# EAGLE design csa_petio_v1.1b (EAGLE 4.15)
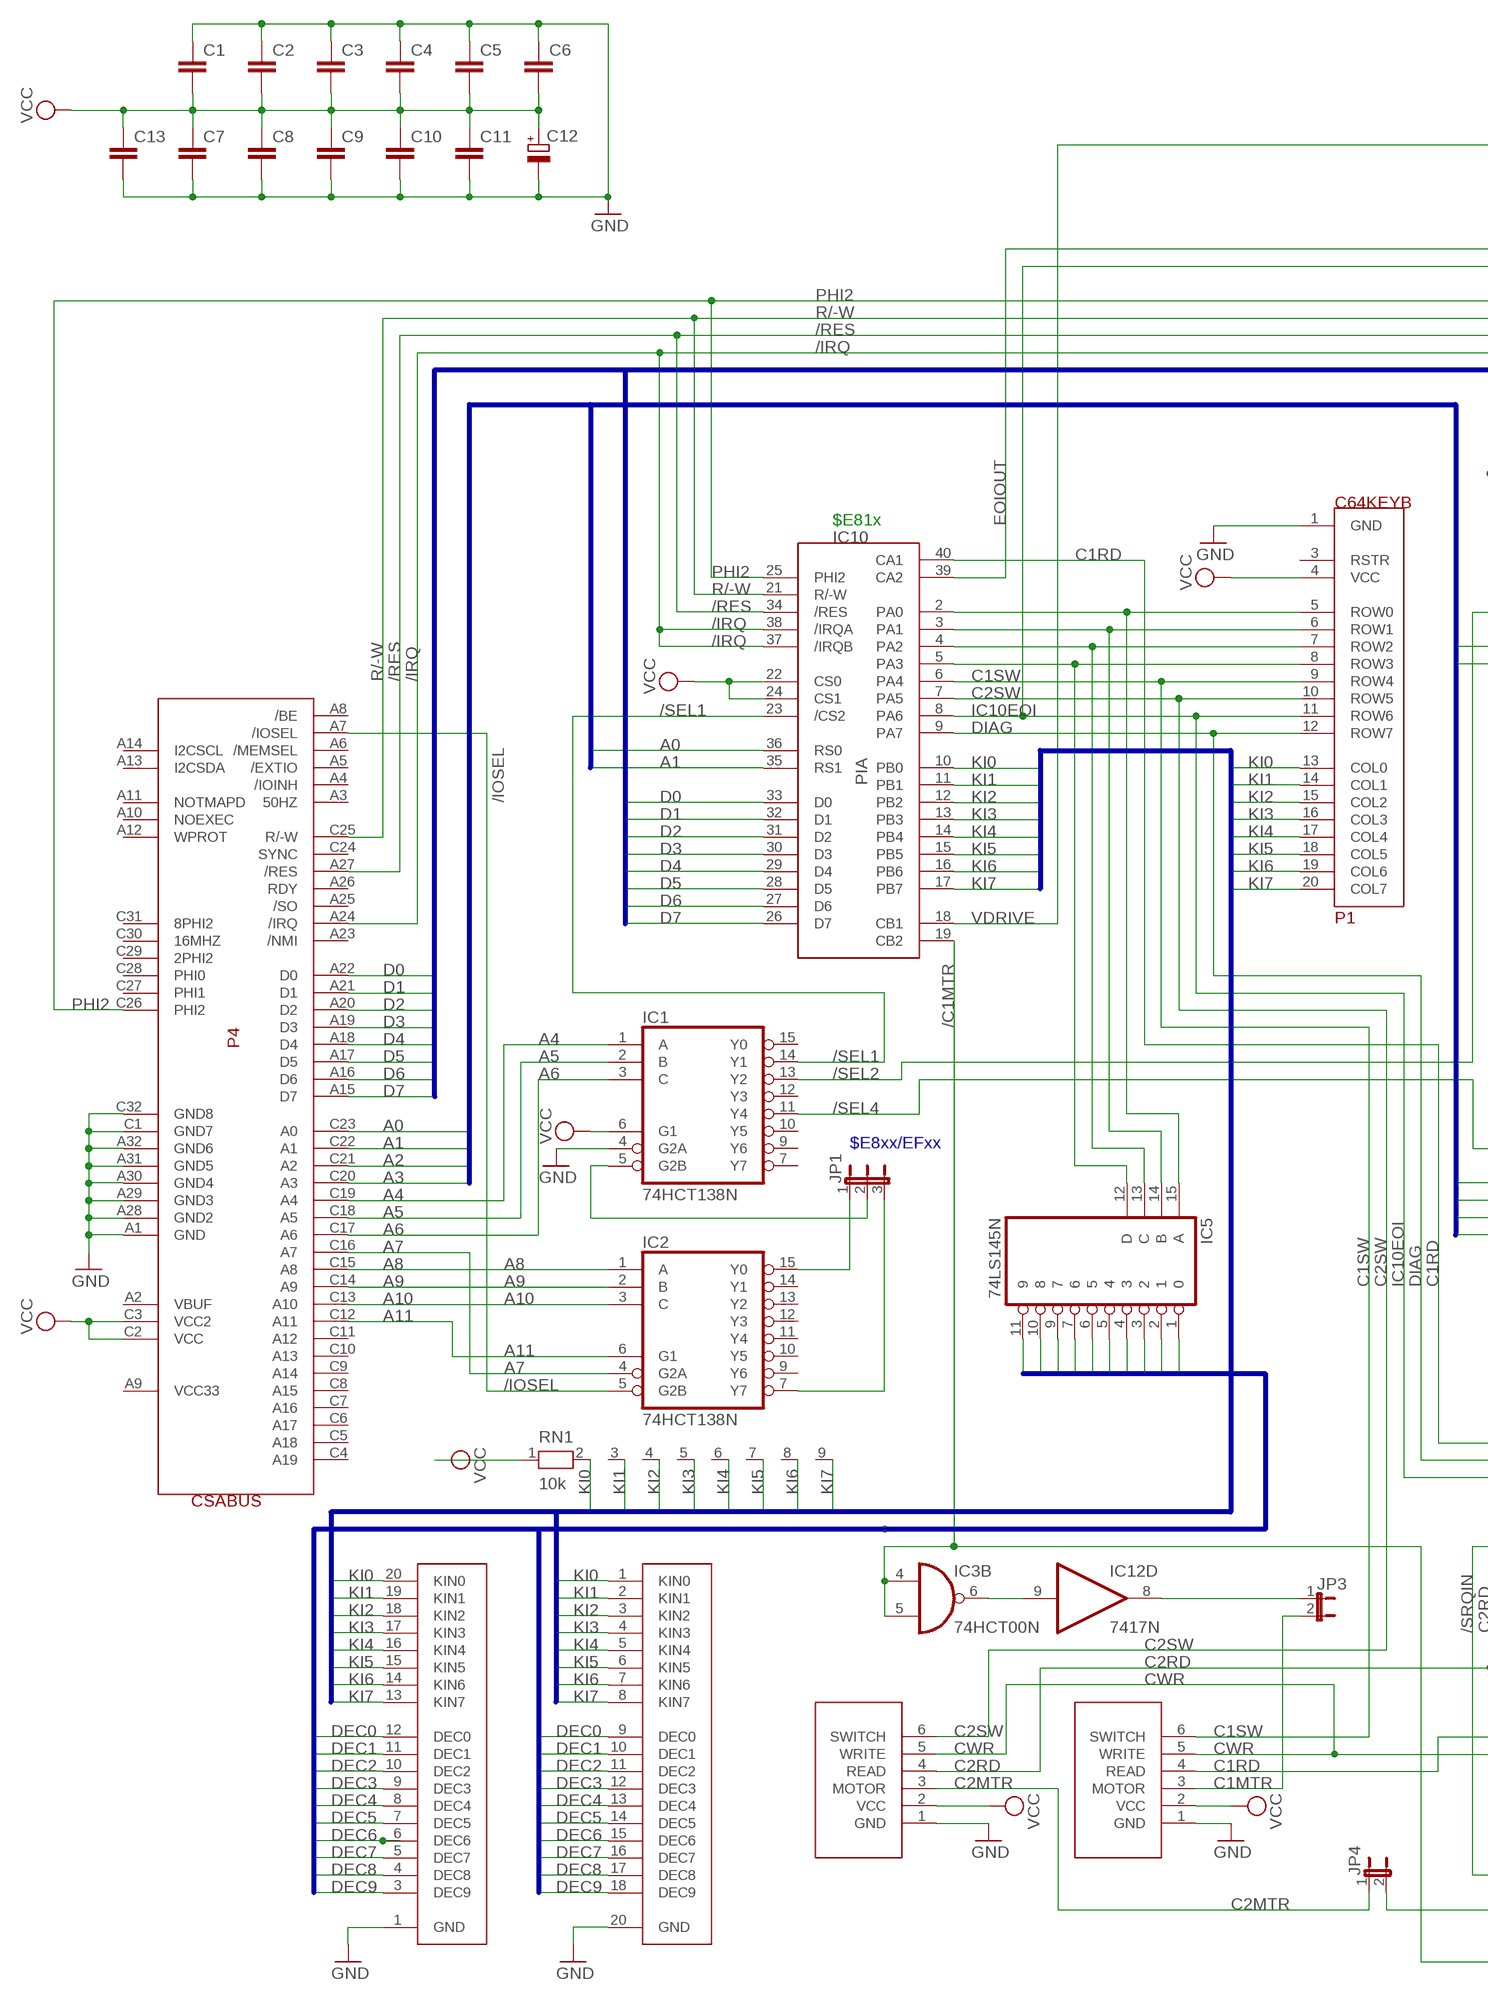
[diagram p0: schematic, sheet 1, part 1 of 2]
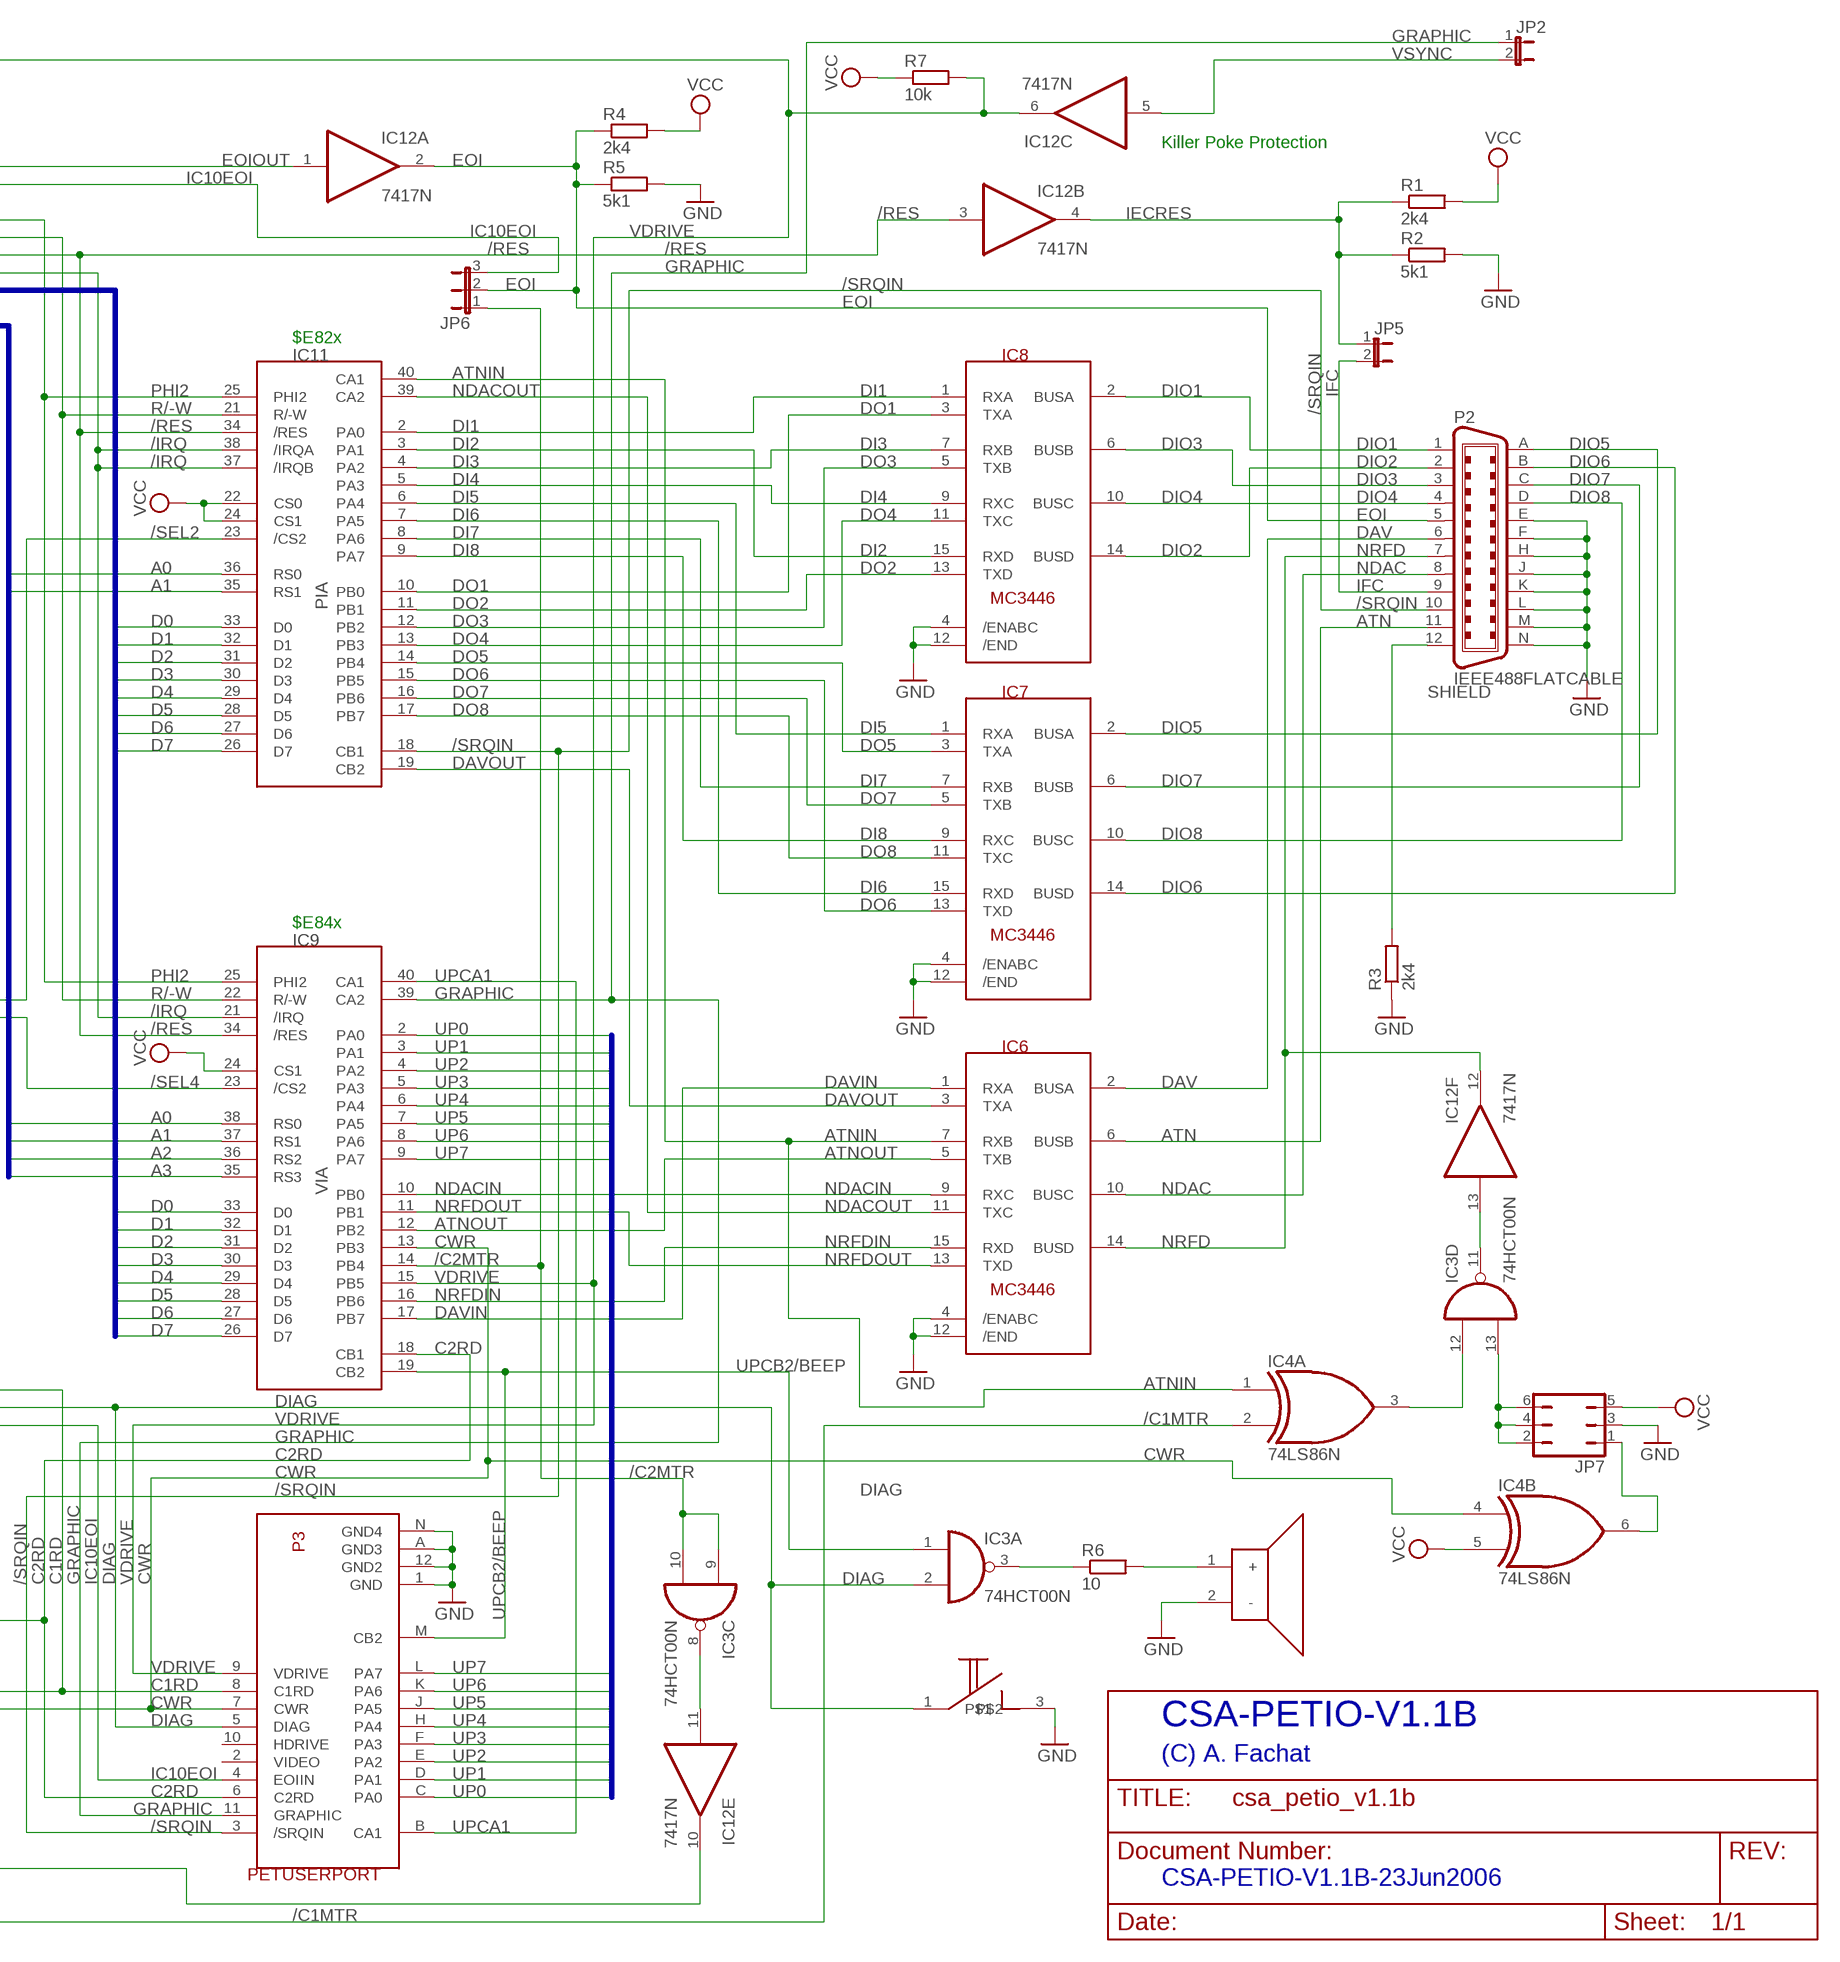
[diagram p1: schematic, sheet 1, part 2 of 2]

## Parts
BEEP1  PIEZOBEEPERPIEZO  [PIEZOBEEPER]
C1  C-EU025-025X050  [C025-025X050]
C2  C-EU025-025X050  [C025-025X050]
C3  C-EU025-025X050  [C025-025X050]
C4  C-EU025-025X050  [C025-025X050]
C5  C-EU025-025X050  [C025-025X050]
C6  C-EU025-025X050  [C025-025X050]
C7  C-EU025-025X050  [C025-025X050]
C8  C-EU025-025X050  [C025-025X050]
C9  C-EU025-025X050  [C025-025X050]
C10  C-EU025-025X050  [C025-025X050]
C11  C-EU025-025X050  [C025-025X050]
C12  CPOL-EUE2.5-6  [E2,5-6]
C13  C-EU025-025X050  [C025-025X050]
IC1  74HCT138N  [DIL16]
IC2  74HCT138N  [DIL16]
IC3  74HCT00N  [DIL14]
IC4  74LS86N  [DIL14]
IC5  74LS145N  [DIL16]
IC6  MC3446  [DIL16]
IC7  MC3446  [DIL16]
IC8  MC3446  [DIL16]
IC9  VIA  [DIL40]
IC10  PIA  [DIL40]
IC11  PIA  [DIL40]
IC12  7417N  [DIL14]
JP1  JP2E  [JP2]
JP2  JP1E  [JP1]
JP3  JP1E  [JP1]
JP4  JP1E  [JP1]
JP5  JP1E  [JP1]
JP6  JP2E  [JP2]
JP7  JP3Q  [JP3Q]
P1  C64KEYB  [C64KEYB]
P2  IEEE488FLATCABLE  [FLAT24]
P3  PETUSERPORT  [FLAT24]
P4  CSABUS  [CSABUS]
P5  CBMTAPE  [JP6]
P6  CBMTAPE  [JP6]
R1  2k4  R-EU_0207/10  [0207/10]
R2  5k1  R-EU_0207/10  [0207/10]
R3  2k4  R-EU_0207/10  [0207/10]
R4  2k4  R-EU_0207/10  [0207/10]
R5  5k1  R-EU_0207/10  [0207/10]
R6  10  R-EU_0207/10  [0207/10]
R7  10k  R-EU_0207/10  [0207/10]
RN1  10k  RN08  [RN-9]
U$1  PETKEYBD  [C64KEYB]
U$2  TASTER  [TASTER]
U$3  PETKEYBDSUBD  [SUBD25F]

## Nets
/C1MTR: IC3.4(B:I0) IC3.5(B:I1) IC4.2(A:I1) IC10.19(CB2)
/C2MTR: IC3.9(C:I0) IC3.10(C:I1) IC9.14(PB4) JP6.1
/IOSEL: IC2.5(G2B) P4.A7(/IOSEL)
/IRQ: IC9.21(/IRQ) IC10.37(/IRQB) IC10.38(/IRQA) IC11.37(/IRQB) IC11.38(/IRQA) P4.A24(/IRQ)
/RES: IC9.34(/RES) IC10.34(/RES) IC11.34(/RES) IC12.3(B:I) P4.A27(/RES)
/SEL1: IC1.14(Y1) IC10.23(/CS2)
/SEL2: IC1.13(Y2) IC11.23(/CS2)
/SEL4: IC1.11(Y4) IC9.23(/CS2)
/SRQIN: IC11.18(CB1) P2.10 P3.3(/SRQIN)
A0: IC9.38(RS0) IC10.36(RS0) IC11.36(RS0) P4.C23(A0)
A1: IC9.37(RS1) IC10.35(RS1) IC11.35(RS1) P4.C22(A1)
A2: IC9.36(RS2) P4.C21(A2)
A3: IC9.35(RS3) P4.C20(A3)
A4: IC1.1(A) P4.C19(A4)
A5: IC1.2(B) P4.C18(A5)
A6: IC1.3(C) P4.C17(A6)
A7: IC2.4(G2A) P4.C16(A7)
A8: IC2.1(A) P4.C15(A8)
A9: IC2.2(B) P4.C14(A9)
A10: IC2.3(C) P4.C13(A10)
A11: IC2.6(G1) P4.C12(A11)
ATN: IC6.6(BUSB) P2.11
ATNIN: IC4.1(A:I0) IC6.7(RXB) IC11.40(CA1)
ATNOUT: IC6.5(TXB) IC9.12(PB2)
C1MTR: JP3.2 P5.3(MOTOR)
C1RD: IC10.40(CA1) P3.8(C1RD) P5.4(READ)
C1SW: IC10.6(PA4) P1.9(ROW4) P5.6(SWITCH)
C2MTR: JP4.1 P6.3(MOTOR)
C2RD: IC9.18(CB1) P3.6(C2RD) P6.4(READ)
C2SW: IC10.7(PA5) P1.10(ROW5) P6.6(SWITCH)
CWR: IC4.4(B:I0) IC9.13(PB3) P3.7(CWR) P5.5(WRITE) P6.5(WRITE)
D0: IC9.33(D0) IC10.33(D0) IC11.33(D0) P4.A22(D0)
D1: IC9.32(D1) IC10.32(D1) IC11.32(D1) P4.A21(D1)
D2: IC9.31(D2) IC10.31(D2) IC11.31(D2) P4.A20(D2)
D3: IC9.30(D3) IC10.30(D3) IC11.30(D3) P4.A19(D3)
D4: IC9.29(D4) IC10.29(D4) IC11.29(D4) P4.A18(D4)
D5: IC9.28(D5) IC10.28(D5) IC11.28(D5) P4.A17(D5)
D6: IC9.27(D6) IC10.27(D6) IC11.27(D6) P4.A16(D6)
D7: IC9.26(D7) IC10.26(D7) IC11.26(D7) P4.A15(D7)
DAV: IC6.2(BUSA) P2.6
DAVIN: IC6.1(RXA) IC9.17(PB7)
DAVOUT: IC6.3(TXA) IC11.19(CB2)
DEC0: IC5.1 U$1.12(DEC0) U$3.9(DEC0)
DEC1: IC5.2 U$1.11(DEC1) U$3.10(DEC1)
DEC2: IC5.3 U$1.10(DEC2) U$3.11(DEC2)
DEC3: IC5.4 U$1.9(DEC3) U$3.12(DEC3)
DEC4: IC5.5 U$1.8(DEC4) U$3.13(DEC4)
DEC5: IC5.6 U$1.7(DEC5) U$3.14(DEC5)
DEC6: IC5.7 U$1.6(DEC6) U$3.15(DEC6)
DEC7: IC5.9 U$1.5(DEC7) U$3.16(DEC7)
DEC8: IC5.10 U$1.4(DEC8) U$3.17(DEC8)
DEC9: IC5.11 U$1.3(DEC9) U$3.18(DEC9)
DI1: IC8.1(RXA) IC11.2(PA0)
DI2: IC8.15(RXD) IC11.3(PA1)
DI3: IC8.7(RXB) IC11.4(PA2)
DI4: IC8.9(RXC) IC11.5(PA3)
DI5: IC7.1(RXA) IC11.6(PA4)
DI6: IC7.15(RXD) IC11.7(PA5)
DI7: IC7.7(RXB) IC11.8(PA6)
DI8: IC7.9(RXC) IC11.9(PA7)
DIAG: IC3.2(A:I1) IC10.9(PA7) P1.12(ROW7) P3.5(DIAG) U$2.1
DIO1: IC8.2(BUSA) P2.1
DIO2: IC8.14(BUSD) P2.2
DIO3: IC8.6(BUSB) P2.3
DIO4: IC8.10(BUSC) P2.4
DIO5: IC7.2(BUSA) P2.A
DIO6: IC7.14(BUSD) P2.B
DIO7: IC7.6(BUSB) P2.C
DIO8: IC7.10(BUSC) P2.D
DO1: IC8.3(TXA) IC11.10(PB0)
DO2: IC8.13(TXD) IC11.11(PB1)
DO3: IC8.5(TXB) IC11.12(PB2)
DO4: IC8.11(TXC) IC11.13(PB3)
DO5: IC7.3(TXA) IC11.14(PB4)
DO6: IC7.13(TXD) IC11.15(PB5)
DO7: IC7.5(TXB) IC11.16(PB6)
DO8: IC7.11(TXC) IC11.17(PB7)
EOI: IC12.2(A:O) JP6.2 P2.5 R4.1 R5.1
EOIOUT: IC10.39(CA2) IC12.1(A:I)
GND: BEEP1.2(-) C1.1 C2.1 C3.1 C4.1 C5.1 C6.1 C7.2 C8.2 C9.2 C10.2 C11.2 C12.- C13.2 IC1.4(G2A) IC6.4(/ENABC) IC6.12(/END) IC7.4(/ENABC) IC7.12(/END) IC8.4(/ENABC) IC8.12(/END) JP7.3 P1.1(GND) P2.E P2.F P2.H P2.J P2.K P2.L P2.M P2.N P3.1(GND) P3.12(GND2) P3.A(GND3) P3.N(GND4) P4.A1(GND) P4.A28(GND2) P4.A29(GND3) P4.A30(GND4) P4.A31(GND5) P4.A32(GND6) P4.C1(GND7) P4.C32(GND8) P5.1(GND) P6.1(GND) R2.2 R3.1 R5.2 U$1.1(GND) U$2.3 U$3.20(GND)
GRAPHIC: IC9.39(CA2) JP2.1 P3.11(GRAPHIC)
IC10EOI: IC10.8(PA6) JP6.3 P1.11(ROW6) P3.4(EOIIN)
IECRES: IC12.4(B:O) JP5.1 R1.1 R2.1
IFC: JP5.2 P2.9
KI0: IC10.10(PB0) P1.13(COL0) RN1.2 U$1.20(KIN0) U$3.1(KIN0)
KI1: IC10.11(PB1) P1.14(COL1) RN1.3 U$1.19(KIN1) U$3.2(KIN1)
KI2: IC10.12(PB2) P1.15(COL2) RN1.4 U$1.18(KIN2) U$3.3(KIN2)
KI3: IC10.13(PB3) P1.16(COL3) RN1.5 U$1.17(KIN3) U$3.4(KIN3)
KI4: IC10.14(PB4) P1.17(COL4) RN1.6 U$1.16(KIN4) U$3.5(KIN4)
KI5: IC10.15(PB5) P1.18(COL5) RN1.7 U$1.15(KIN5) U$3.6(KIN5)
KI6: IC10.16(PB6) P1.19(COL6) RN1.8 U$1.14(KIN6) U$3.7(KIN6)
KI7: IC10.17(PB7) P1.20(COL7) RN1.9 U$1.13(KIN7) U$3.8(KIN7)
N$1: IC3.12(D:I0) IC4.3(A:O)
N$2: IC3.13(D:I1) JP7.2 JP7.4 JP7.6
N$3: IC3.3(A:O) R6.1
N$4: BEEP1.1(+) R6.2
N$15: IC3.11(D:O) IC12.13(F:I)
N$16: IC3.6(B:O) IC12.9(D:I)
N$17: IC12.8(D:O) JP3.1
N$19: IC12.10(E:O) JP4.2
N$20: IC5.15(A) IC10.2(PA0) P1.5(ROW0)
N$21: IC5.14(B) IC10.3(PA1) P1.6(ROW1)
N$22: IC5.13(C) IC10.4(PA2) P1.7(ROW2)
N$23: IC5.12(D) IC10.5(PA3) P1.8(ROW3)
N$24: IC3.8(C:O) IC12.11(E:I)
N$27: IC4.6(B:O) JP7.1
N$32: IC1.5(G2B) JP1.2
N$33: IC2.15(Y0) JP1.1
N$34: IC2.7(Y7) JP1.3
NDAC: IC6.10(BUSC) P2.8
NDACIN: IC6.9(RXC) IC9.10(PB0)
NDACOUT: IC6.11(TXC) IC11.39(CA2)
NRFD: IC6.14(BUSD) IC12.12(F:O) P2.7
NRFDIN: IC6.15(RXD) IC9.16(PB6)
NRFDOUT: IC6.13(TXD) IC9.11(PB1)
PHI2: IC9.25(PHI2) IC10.25(PHI2) IC11.25(PHI2) P4.C26(PHI2)
R/-W: IC9.22(R/-W) IC10.21(R/-W) IC11.21(R/-W) P4.C25(R/-W)
SHIELD: P2.12 R3.2
UP0: IC9.2(PA0) P3.C(PA0)
UP1: IC9.3(PA1) P3.D(PA1)
UP2: IC9.4(PA2) P3.E(PA2)
UP3: IC9.5(PA3) P3.F(PA3)
UP4: IC9.6(PA4) P3.H(PA4)
UP5: IC9.7(PA5) P3.J(PA5)
UP6: IC9.8(PA6) P3.K(PA6)
UP7: IC9.9(PA7) P3.L(PA7)
UPCA1: IC9.40(CA1) P3.B(CA1)
UPCB2/BEEP: IC3.1(A:I0) IC9.19(CB2) P3.M(CB2)
VCC: C1.2 C2.2 C3.2 C4.2 C5.2 C6.2 C7.1 C8.1 C9.1 C10.1 C11.1 C12.+ C13.1 IC1.6(G1) IC4.5(B:I1) IC9.24(CS1) IC10.22(CS0) IC10.24(CS1) IC11.22(CS0) IC11.24(CS1) JP7.5 P1.4(VCC) P4.C2(VCC) P4.C3(VCC2) P5.2(VCC) P6.2(VCC) R1.2 R4.2 R7.1 RN1.1
VDRIVE: IC9.15(PB5) IC10.18(CB1) IC12.6(C:O) P3.9(VDRIVE) R7.2
VSYNC: IC12.5(C:I) JP2.2
Unconnected: IC1.7(Y7) IC1.9(Y6) IC1.10(Y5) IC1.12(Y3) IC1.15(Y0) IC2.9(Y6) IC2.10(Y5) IC2.11(Y4) IC2.12(Y3) IC2.13(Y2) IC2.14(Y1) IC4.8(C:O) IC4.9(C:I0) IC4.10(C:I1) IC4.11(D:O) IC4.12(D:I0) IC4.13(D:I1) P1.3(RSTR) P3.2(VIDEO) P3.10(HDRIVE) P4.A2(VBUF) P4.A3(50HZ) P4.A4(/IOINH) P4.A5(/EXTIO) P4.A6(/MEMSEL) P4.A8(/BE) P4.A9(VCC33) P4.A10(NOEXEC) P4.A11(NOTMAPD) P4.A12(WPROT) P4.A13(I2CSDA) P4.A14(I2CSCL) P4.A23(/NMI) P4.A25(/SO) P4.A26(RDY) P4.C4(A19) P4.C5(A18) P4.C6(A17) P4.C7(A16) P4.C8(A15) P4.C9(A14) P4.C10(A13) P4.C11(A12) P4.C24(SYNC) P4.C27(PHI1) P4.C28(PHI0) P4.C29(2PHI2) P4.C30(16MHZ) P4.C31(8PHI2)

## Buses
D[0..7]
A[0..3]
KI[0..7]
UP[0..7]
DEC[0..9]

## Notes on the sheet
- Killer Poke Protection
- $E82x
- $E81x
- $E84x
- $E8xx/EFxx
- CSA-PETIO-V1.1B
- (C) A. Fachat
- CSA-PETIO-V1.1B-23Jun2006

## Power pins joined to a net without a drawn wire
GND: IC1.8(GND) IC2.8(GND) IC3.7(P:GND) IC4.7(P:GND) IC5.8(GND) IC6.8(GND) IC7.8(GND) IC8.8(GND) IC9.1(GND) IC10.1(GND) IC11.1(GND) IC12.7(P:GND)
VCC: IC1.16(VCC) IC2.16(VCC) IC3.14(P:VCC) IC4.14(P:VCC) IC5.16(VCC) IC6.16(VCC) IC7.16(VCC) IC8.16(VCC) IC9.20(VCC) IC10.20(VCC) IC11.20(VCC) IC12.14(P:VCC)

## Library data of the parts
BEEP1 = csa:PIEZOBEEPER
C1-C11 C13 = rcl:C-EU: CAPACITOR, European symbol
C12 = rcl:CPOL-EU: POLARIZED CAPACITOR, European symbol
IC1 IC2 = 74xx-eu:74*138: 3-line to 8-line DECODER/DEMULTIPLEXER
IC3 = 74xx-eu:74*00: Quad 2-input NAND gate
IC4 = 74xx-us:74*86: Quad 2-input EXCLUSIV-OR (XOR) gate
IC5 = 74xx-eu:74*145: BCD to decimal DECODER/DRIVER
IC6-IC8 = csa:MC3446
IC9 = csa:VIA
IC10 IC11 = csa:PIA
IC12 = 74xx-eu:74*17: Hex open collector, high-voltage
JP1 JP6 = jumper:JP2E: JUMPER
JP2-JP5 = jumper:JP1E: JUMPER
JP7 = jumper:JP3Q: JUMPER
P1 = csa:C64KEYB
P2 = csa:IEEE488
P3 = csa:PETUSERPORT
P4 = csa:CSABUS
P5 P6 = csa:CBMTAPE
R1-R7 = rcl:R-EU_: RESISTOR, European symbol
RN1 = resistor-net:RN08: RESISTOR NETWORK
U$1 U$3 = csa:PETKEYBD
U$2 = csa:TASTER

## Board
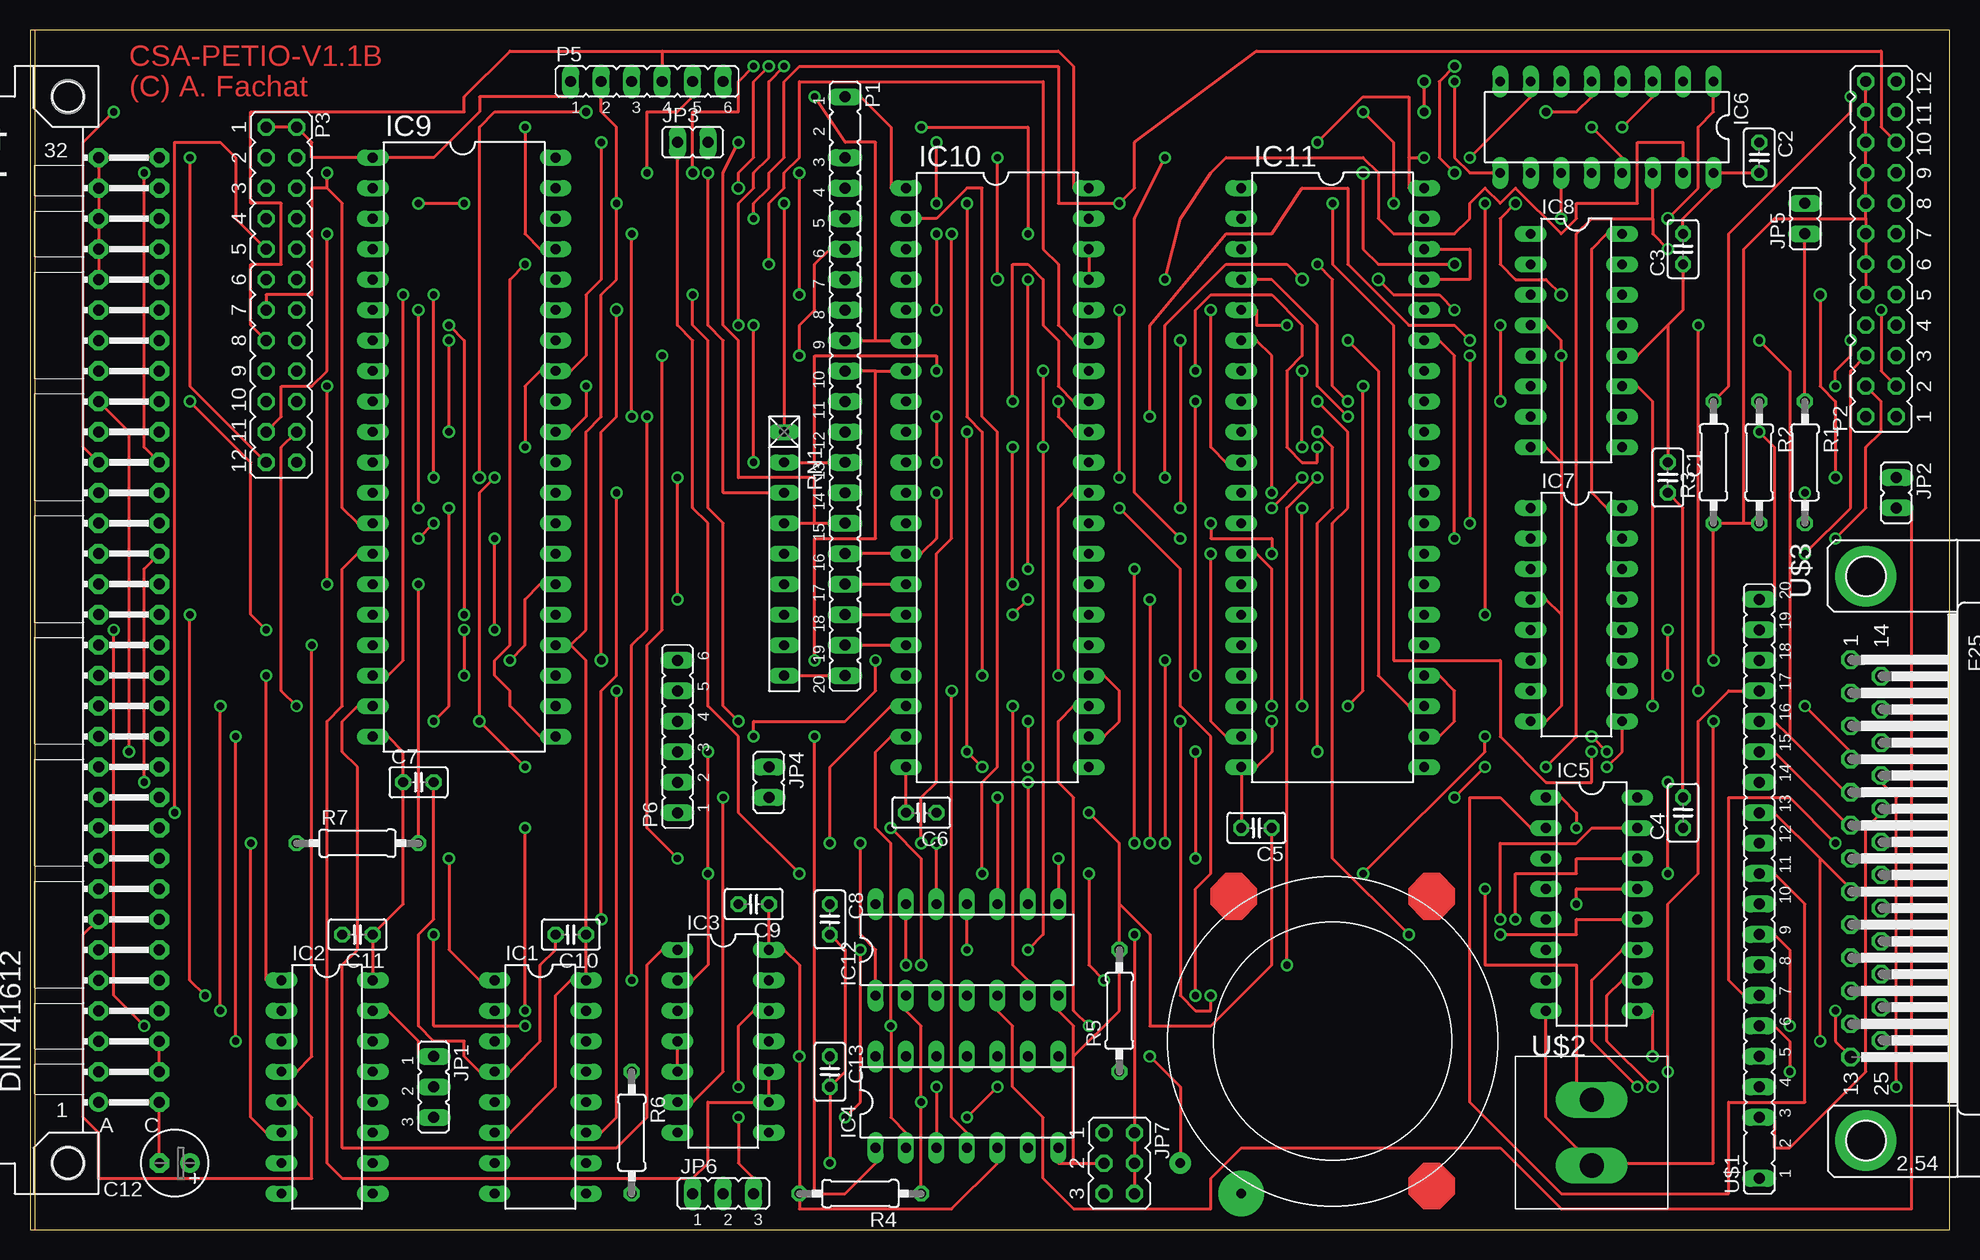
[diagram p2: board, top side]
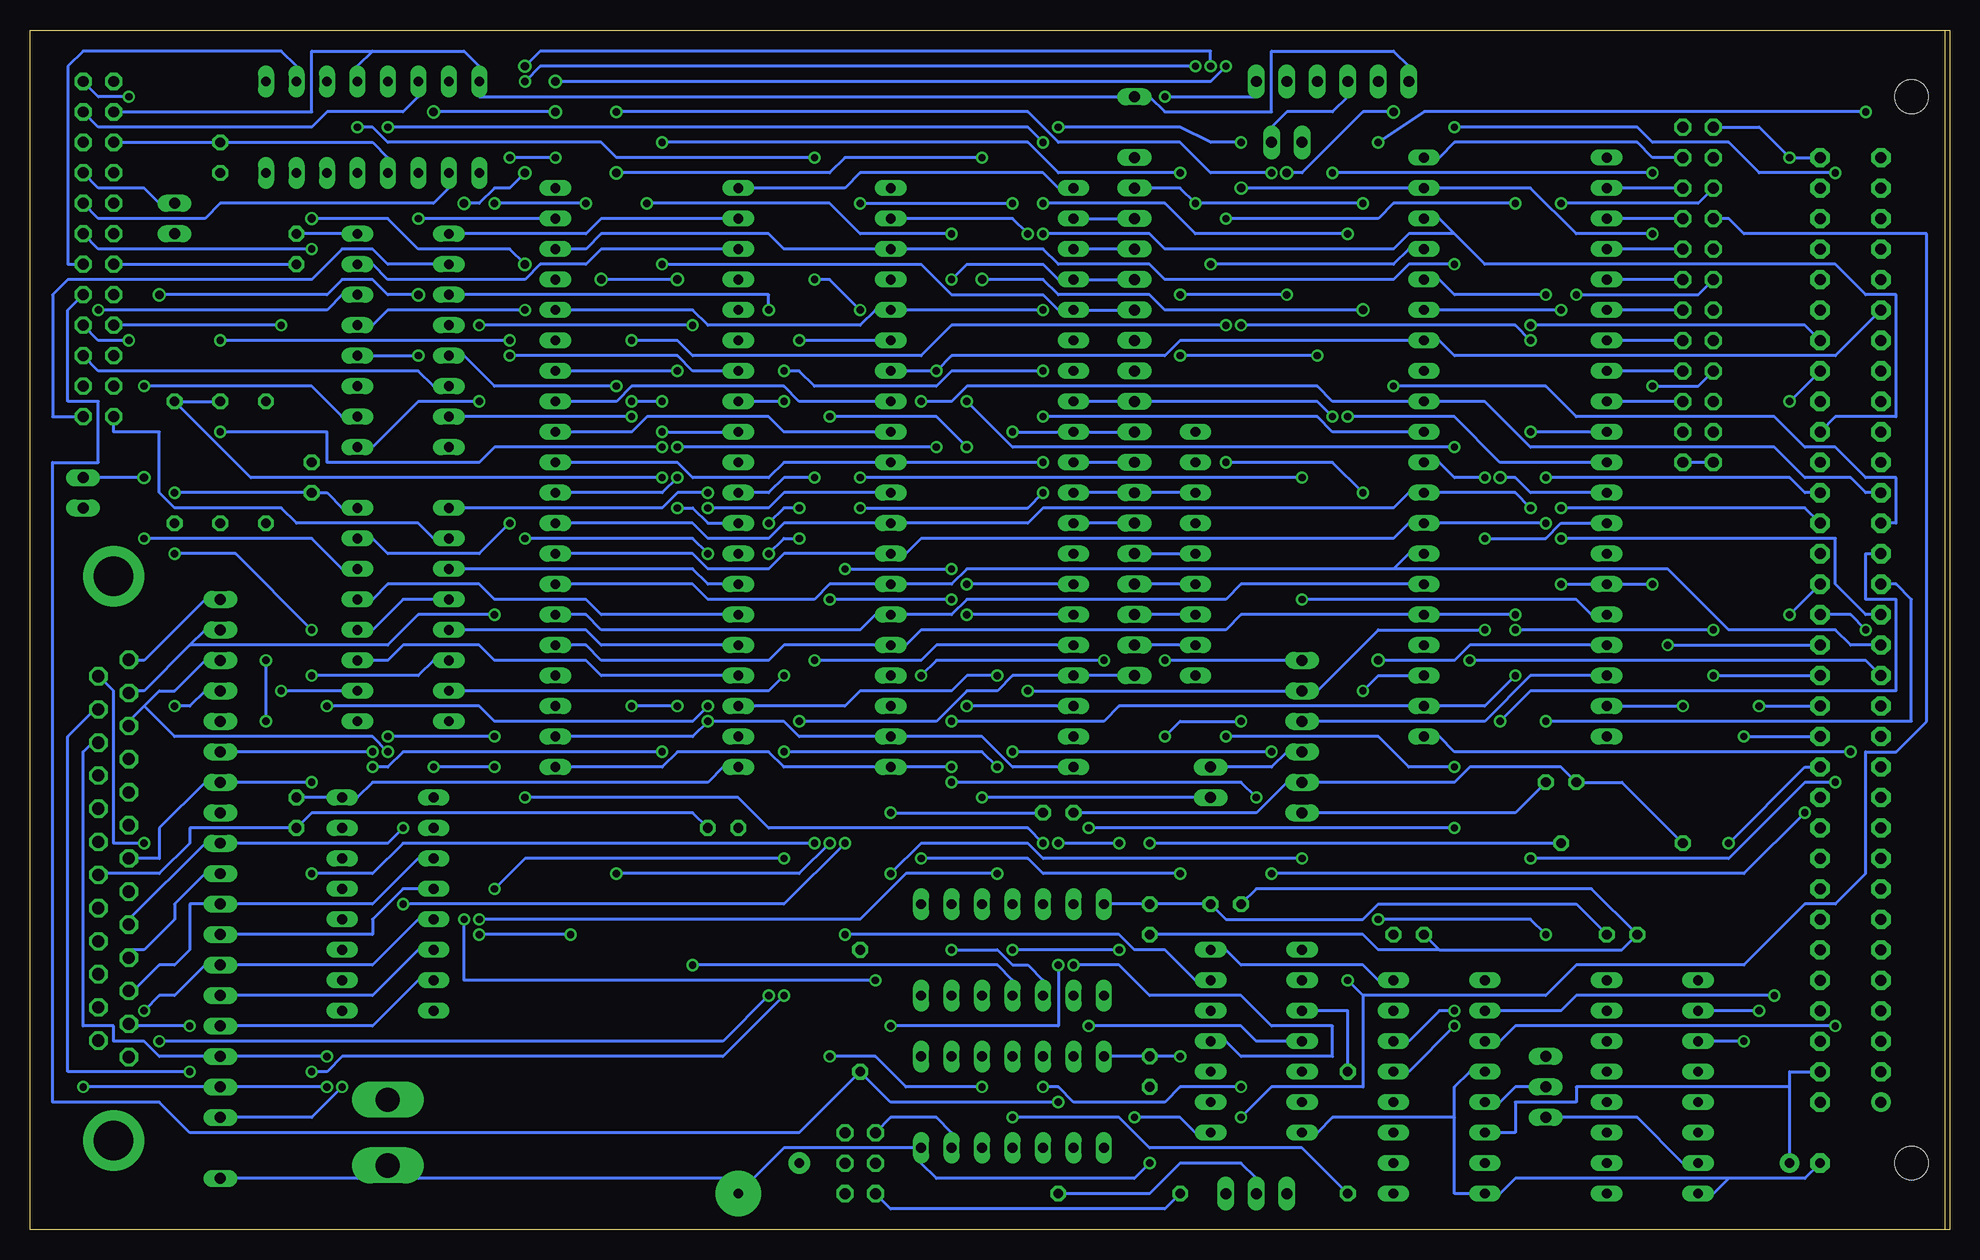
[diagram p3: board, bottom side, seen from below]

Size 160 x 100.03 mm. Coordinates in mm from the lower left corner, seen from the top.
Outline: 0,0.01 160,0.01 160,100.01 0,100.01 0,0.01
Copper layers (1*16): Top 0.035mm / dielectric 1.5mm / Bottom 0.035mm
Design rules "default": minimum track width 10mil, minimum drill 24mil, track to track 8mil, track to pad 8mil, pad to pad 8mil, via to via 8mil, smd to smd 8mil, copper to edge 40mil, drill to drill 8mil, minimum pad ring 10mil, minimum via ring 8mil, stop-mask expansion 4mil, vias tented up to drill 0mil, thermal gap 10mil

### Footprints (pad centres in the part's own frame; a part is rotated, then mirrored left to right if it is on the bottom)
PIEZOBEEPER = drill 0.8 pad 1.778 round: 1 -10.16,12.7 | drill 0.8 pad 3.81 round: 2 -12.7,7.62
C025-025X050 = drill 0.813 octagon: 1 -1.27,0; 2 1.27,0
E2,5-6 = drill 0.813 pad 1.6 round: + -1.27,0 | drill 0.813 pad 1.6 octagon: - 1.27,0
DIL16 = drill 0.813 long: 1 -8.89,-3.81; 2 -6.35,-3.81; 3 -3.81,-3.81; 4 -1.27,-3.81; 5 1.27,-3.81; 6 3.81,-3.81; 7 6.35,-3.81; 8 8.89,-3.81; 9 8.89,3.81; 10 6.35,3.81; 11 3.81,3.81; 12 1.27,3.81; 13 -1.27,3.81; 14 -3.81,3.81; 15 -6.35,3.81; 16 -8.89,3.81
DIL14 = drill 0.813 long: 1 -7.62,-3.81; 2 -5.08,-3.81; 3 -2.54,-3.81; 4 0,-3.81; 5 2.54,-3.81; 6 5.08,-3.81; 7 7.62,-3.81; 8 7.62,3.81; 9 5.08,3.81; 10 2.54,3.81; 11 0,3.81; 12 -2.54,3.81; 13 -5.08,3.81; 14 -7.62,3.81
DIL40 = drill 0.813 long: 1 -16.51,-7.62; 2 -13.97,-7.62; 3 -11.43,-7.62; 4 -8.89,-7.62; 5 -6.35,-7.62; 6 -3.81,-7.62; 7 -1.27,-7.62; 8 1.27,-7.62; 9 3.81,-7.62; 10 6.35,-7.62; 11 8.89,-7.62; 12 11.43,-7.62; 13 13.97,-7.62; 14 16.51,-7.62; 15 19.05,-7.62; 16 21.59,-7.62; 17 24.13,-7.62; 18 26.67,-7.62; 19 29.21,-7.62; 20 31.75,-7.62; 21 31.75,7.62; 22 29.21,7.62; 23 26.67,7.62; 24 24.13,7.62; 25 21.59,7.62; 26 19.05,7.62; 27 16.51,7.62; 28 13.97,7.62; 29 11.43,7.62; 30 8.89,7.62; 31 6.35,7.62; 32 3.81,7.62; 33 1.27,7.62; 34 -1.27,7.62; 35 -3.81,7.62; 36 -6.35,7.62; 37 -8.89,7.62; 38 -11.43,7.62; 39 -13.97,7.62; 40 -16.51,7.62
JP2 = drill 0.914 long: 1 -2.54,0; 2 0,0; 3 2.54,0
JP1 = drill 0.914 long: 1 0,-1.27; 2 0,1.27
JP3Q = drill 0.914 octagon: 1 -2.54,-1.27; 2 -2.54,1.27; 3 0,-1.27; 4 0,1.27; 5 2.54,-1.27; 6 2.54,1.27
C64KEYB = drill 0.914 long: 1 0,0; 3 5.08,0; 4 7.62,0; 5 10.16,0; 6 12.7,0; 7 15.24,0; 8 17.78,0; 9 20.32,0; 10 22.86,0; 11 25.4,0; 12 27.94,0; 13 30.48,0; 14 33.02,0; 15 35.56,0; 16 38.1,0; 17 40.64,0; 18 43.18,0; 19 45.72,0; 20 48.26,0
FLAT24 = drill 0.914 octagon: 1 -13.97,-1.27; 2 -11.43,-1.27; 3 -8.89,-1.27; 4 -6.35,-1.27; 5 -3.81,-1.27; 6 -1.27,-1.27; 7 1.27,-1.27; 8 3.81,-1.27; 9 6.35,-1.27; 10 8.89,-1.27; 11 11.43,-1.27; 12 13.97,-1.27; A -13.97,1.27; B -11.43,1.27; C -8.89,1.27; D -6.35,1.27; E -3.81,1.27; F -1.27,1.27; H 1.27,1.27; J 3.81,1.27; K 6.35,1.27; L 8.89,1.27; M 11.43,1.27; N 13.97,1.27
CSABUS = drill 0.914 pad 1.6 round: A1 7.62,36.83 | drill 0.914 pad 1.6 octagon: A2 7.62,34.29; A3 7.62,31.75; A4 7.62,29.21; A5 7.62,26.67; A6 7.62,24.13; A7 7.62,21.59; A8 7.62,19.05; A9 7.62,16.51; A10 7.62,13.97; A11 7.62,11.43; A12 7.62,8.89; A13 7.62,6.35; A14 7.62,3.81; A15 7.62,1.27; A16 7.62,-1.27; A17 7.62,-3.81; A18 7.62,-6.35; A19 7.62,-8.89; A20 7.62,-11.43; A21 7.62,-13.97; A22 7.62,-16.51; A23 7.62,-19.05; A24 7.62,-21.59; A25 7.62,-24.13; A26 7.62,-26.67; A27 7.62,-29.21; A28 7.62,-31.75; A29 7.62,-34.29; A30 7.62,-36.83; A31 7.62,-39.37; A32 7.62,-41.91; C1 2.54,36.83; C2 2.54,34.29; C3 2.54,31.75; C4 2.54,29.21; C5 2.54,26.67; C6 2.54,24.13; C7 2.54,21.59; C8 2.54,19.05; C9 2.54,16.51; C10 2.54,13.97; C11 2.54,11.43; C12 2.54,8.89; C13 2.54,6.35; C14 2.54,3.81; C15 2.54,1.27; C16 2.54,-1.27; C17 2.54,-3.81; C18 2.54,-6.35; C19 2.54,-8.89; C20 2.54,-11.43; C21 2.54,-13.97; C22 2.54,-16.51; C23 2.54,-19.05; C24 2.54,-21.59; C25 2.54,-24.13; C26 2.54,-26.67; C27 2.54,-29.21; C28 2.54,-31.75; C29 2.54,-34.29; C30 2.54,-36.83; C31 2.54,-39.37; C32 2.54,-41.91 | hole 2.794: 10.16,41.91; 10.16,-46.99
JP6 = drill 0.914 long: 1 -7.62,1.27; 2 -5.08,1.27; 3 -2.54,1.27; 4 0,1.27; 5 2.54,1.27; 6 5.08,1.27
0207/10 = drill 0.813 octagon: 1 -5.08,0; 2 5.08,0
RN-9 = drill 0.813 long: 1 -10.16,0; 2 -7.62,0; 3 -5.08,0; 4 -2.54,0; 5 0,0; 6 2.54,0; 7 5.08,0; 8 7.62,0; 9 10.16,0
TASTER = drill 2.007 long: 1 0,4.013; 3 0,-1.473
SUBD25F = drill 1.016 octagon: 1 -14.021,-10.16; 2 -11.252,-10.16; 3 -8.509,-10.16; 4 -5.74,-10.16; 5 -2.972,-10.16; 6 -0.229,-10.16; 7 2.54,-10.16; 8 5.309,-10.16; 9 8.052,-10.16; 10 10.82,-10.16; 11 13.589,-10.16; 12 16.332,-10.16; 13 19.101,-10.16; 14 -12.649,-7.62; 15 -9.881,-7.62; 16 -7.112,-7.62; 17 -4.369,-7.62; 18 -1.6,-7.62; 19 1.168,-7.62; 20 3.912,-7.62; 21 6.68,-7.62; 22 9.449,-7.62; 23 12.192,-7.62; 24 14.961,-7.62; 25 17.729,-7.62 | drill 3.302 pad 5.08 round: G1 -20.98,-8.89; G2 26.06,-8.89

### Placement (x,y rotation side)
BEEP1  108.58,15.72 90 top
C1  136.52,62.71 270 top
C2  144.14,89.38 270 top
C3  137.79,81.76 90 top
C4  137.79,34.77 90 top
C5  102.23,33.5 180 top
C6  74.29,34.77 180 top
C7  32.38,37.31 0 top
C8  66.67,25.88 270 top
C9  60.32,27.15 180 top
C10  45.08,24.61 180 top
C11  27.3,24.61 180 top
C12  12.06,5.56 180 top
C13  66.67,13.18 270 top
IC1  42.54,11.91 270 top
IC2  24.76,11.91 270 top
IC3  57.78,15.72 270 top
IC4  78.1,10.64 0 top
IC5  130.17,27.15 270 top
IC6  131.44,91.92 180 top
IC7  128.9,51.28 270 top
IC8  128.9,74.14 270 top
IC9  36.19,72.87 270 top
IC10  80.64,70.33 270 top
IC11  108.58,70.33 270 top
IC12  78.1,23.34 0 top
JP1  33.65,11.91 270 top
JP2  155.57,61.44 180 top
JP3  55.24,90.65 270 top
JP4  61.59,37.31 180 top
JP5  147.95,84.3 0 top
JP6  57.78,3.02 0 top
JP7  90.8,5.56 270 top
P1  67.94,94.46 270 top
P2  154.3,81.76 90 top
P3  20.95,77.95 270 top
P4  13.33,47.47 180 top
P5  52.7,94.46 0 top
P6  55.24,42.39 90 top
R1  147.95,63.98 270 top
R2  144.14,63.98 270 top
R3  140.33,63.98 90 top
R4  69.21,3.02 180 top
R5  90.8,18.26 90 top
R6  50.16,8.1 270 top
R7  27.3,32.23 0 top
RN1  62.86,56.36 270 top
U$1  144.14,4.29 90 top
U$2  130.17,6.83 0 top
U$3  161.92,33.5 270 top

### Tracks (layer width: path | path; a pad name or v marks a point on that pad's centre or on a via)
/C1MTR  (via drill 0.61)
  Top 0.254: IC3.5 IC3.4 | IC4.2 73.02,8.1 71.75,9.37 v71.75,16.99 71.75,32.23 70.48,33.5 70.48,39.85 71.75,41.12 IC10.19
  Bottom 0.254: v71.75,16.99 59.05,16.99 57.78,15.72 IC3.4
/C2MTR
  Top 0.254: IC3.10 IC3.9 56.51,10.64 56.51,5.56 55.24,4.29 | 55.24,4.29 26.03,4.29 24.76,5.56 24.76,42.39 26.03,43.66 26.03,55.09 27.3,56.36 IC9.14 | 55.24,4.29 JP6.1
/IOSEL
  Top 0.254: P4.A7 4.44,24.61 4.44,9.37 5.71,8.1 5.71,4.29 23.49,4.29 23.49,9.37 22.22,10.64 IC2.5
/IRQ  (via drill 0.61)
  Top 0.254: IC10.38 IC10.37 | IC11.38 120.01,81.76 120.01,79.22 IC11.37 | v8.25,39.85 8.25,66.52 P4.A24 | v41.27,80.49 40,79.22 40,48.74 38.73,47.47 38.73,46.2 40,44.93 40,43.66 42.54,41.12 IC9.21
  Bottom 0.254: IC11.38 113.66,81.76 112.39,83.03 98.42,83.03 97.15,81.76 IC10.38 75.56,81.76 74.29,80.49 66.67,80.49 65.4,79.22 46.35,79.22 45.08,80.49 v41.27,80.49 | v8.25,39.85 41.27,39.85 42.54,41.12 IC9.21
/RES  (via drill 0.61)
  Top 0.254: v83.18,23.34 84.45,24.61 v84.45,65.25 v84.45,71.6 | v106.04,65.25 v106.04,71.6
  Bottom 0.254: P4.A27 9.52,72.87 41.27,72.87 42.54,74.14 IC9.34 64.13,74.14 65.4,72.87 83.18,72.87 v84.45,71.6 IC10.34 | v83.18,23.34 79.37,23.34 78.1,22.07 76.83,22.07 75.56,20.8 IC12.3 | v84.45,65.25 v106.04,65.25 | v106.04,71.6 IC11.34
/SEL1  (via drill 0.61)
  Top 0.254: v41.27,18.26 v41.27,33.5 | v71.75,33.5 74.29,30.96 v74.29,22.07 | v88.26,16.99 86.99,18.26 86.99,36.04 85.72,37.31 85.72,42.39 86.99,43.66 IC10.23
  Bottom 0.254: v41.27,18.26 42.54,18.26 45.08,15.72 IC1.14 | v41.27,33.5 v71.75,33.5 | v74.29,22.07 74.29,16.99 v88.26,16.99
/SEL2  (via drill 0.61)
  Top 0.254: v41.27,16.99 33.65,16.99 v33.65,24.61 | v47.62,25.88 47.62,44.93 48.89,46.2 v48.89,61.44 | v60.32,63.98 v60.32,75.41 | v109.85,74.14 112.39,71.6 112.39,46.2 114.93,43.66 IC11.23
  Bottom 0.254: v41.27,16.99 45.08,13.18 IC1.13 | v33.65,24.61 34.92,25.88 v47.62,25.88 | v48.89,61.44 51.43,63.98 v60.32,63.98 | v60.32,75.41 83.18,75.41 85.72,72.87 104.77,72.87 106.04,74.14 v109.85,74.14
/SEL4  (via drill 0.61)
  Top 0.254: v48.89,44.93 48.89,9.37 47.62,8.1 IC1.11
  Bottom 0.254: v48.89,44.93 47.62,46.2 IC9.23
/SRQIN  (via drill 0.61)
  Top 0.254: v78.1,85.57 78.1,67.79 79.37,66.52 v79.37,46.2 | P2.10 154.3,91.92 154.3,98.27 102.23,98.27 92.07,90.65 92.07,86.84 v90.8,85.57 85.72,85.57 85.72,97 64.13,97 62.86,95.73 62.86,89.38 61.59,88.11 61.59,86.84 60.32,85.57 v60.32,84.3 | v32.38,85.57 v36.19,85.57
  Bottom 0.254: v79.37,46.2 81.91,46.2 83.18,44.93 90.8,44.93 92.07,43.66 IC11.18 | v90.8,85.57 v78.1,85.57 | P3.3 20.95,85.57 v32.38,85.57 | v36.19,85.57 46.35,85.57 47.62,84.3 v60.32,84.3
A0  (via drill 0.61)
  Top 0.254: v75.56,83.03 v75.56,76.68
  Bottom 0.254: IC11.36 104.77,76.68 103.5,75.41 90.8,75.41 89.53,76.68 IC10.36 v75.56,76.68 | 41.27,83.03 38.73,80.49 9.52,80.49 6.98,77.95 4.44,77.95 4.44,67.79 9.52,67.79 P4.C23 | 41.27,83.03 42.54,84.3 IC9.38 | 41.27,83.03 45.08,83.03 46.35,81.76 65.4,81.76 66.67,83.03 v75.56,83.03
A1  (via drill 0.61)
  Top 0.254: v61.59,80.49 61.59,85.57 62.86,86.84 62.86,88.11 64.13,89.38 64.13,95.73 84.45,95.73 84.45,81.76 85.72,80.49 85.72,75.41 86.99,74.14 IC10.35 | v118.74,57.63 118.74,72.87 117.47,74.14 IC11.35 | v103.5,56.36 103.5,57.63 98.42,57.63 v98.42,58.9 | v95.88,74.14 v95.88,60.17 | P4.C22 9.52,65.25 v9.52,88.11 | v41.27,91.92 41.27,83.03 42.54,81.76 IC9.37
  Bottom 0.254: IC9.37 45.08,81.76 46.35,80.49 v61.59,80.49 | v118.74,57.63 104.77,57.63 v103.5,56.36 | v98.42,58.9 97.15,60.17 v95.88,60.17 | IC10.35 v95.88,74.14 | v9.52,88.11 15.87,88.11 18.41,90.65 24.76,90.65 26.03,91.92 v41.27,91.92
A2  (via drill 0.61)
  Top 0.254: v33.65,62.71 v33.65,77.95
  Bottom 0.254: v33.65,77.95 41.27,77.95 42.54,79.22 IC9.36 | v33.65,62.71 13.33,62.71 12.06,61.44 P4.C21
A3  (via drill 0.61)
  Top 0.254: v32.38,60.17 v32.38,76.68
  Bottom 0.254: v32.38,60.17 12.06,60.17 P4.C20 | v32.38,76.68 IC9.35
A4  (via drill 0.61)
  Top 0.254: v34.92,30.96 34.92,23.34 37.46,20.8 IC1.1 | v9.52,37.31 9.52,55.09 P4.C19
  Bottom 0.254: v34.92,30.96 18.41,30.96 12.06,37.31 v9.52,37.31
A5  (via drill 0.61)
  Top 0.254: v14.6,19.53 13.33,20.8 v13.33,51.28
  Bottom 0.254: v14.6,19.53 31.11,19.53 32.38,18.26 IC1.2 | v13.33,51.28 P4.C18
A6  (via drill 0.61)
  Top 0.254: v9.52,16.99 6.98,19.53 v6.98,50.01
  Bottom 0.254: v9.52,16.99 36.19,16.99 37.46,15.72 IC1.3 | v6.98,50.01 8.25,51.28 P4.C17
A7  (via drill 0.61)
  Top 0.254: v23.49,48.74 23.49,14.45 22.22,13.18 IC2.4
  Bottom 0.254: v23.49,48.74 P4.C16
A8  (via drill 0.61)
  Top 0.254: v19.68,46.2 19.68,20.8 IC2.1
  Bottom 0.254: v19.68,46.2 P4.C15
A9  (via drill 0.61)
  Top 0.254: v15.87,18.26 v15.87,43.66
  Bottom 0.254: v15.87,43.66 P4.C14 | v15.87,18.26 IC2.2
A10  (via drill 0.61)
  Top 0.254: v17.14,15.72 v17.14,41.12
  Bottom 0.254: v17.14,41.12 P4.C13 | v17.14,15.72 IC2.3
A11  (via drill 0.61)
  Top 0.254: v18.41,32.23 18.41,9.37 19.68,8.1 IC2.6
  Bottom 0.254: v18.41,32.23 12.06,38.58 P4.C12
ATN
  Bottom 0.254: P2.11 154.3,91.92 136.52,91.92 135.25,93.19 128.9,93.19 127.63,94.46 IC6.6
ATNIN  (via drill 0.61)
  Top 0.254: v65.4,41.12 65.4,3.02 67.94,3.02 70.48,5.56 IC4.1 | v59.05,42.39 57.78,43.66 57.78,58.9 56.51,60.17 56.51,74.14 55.24,75.41 v55.24,77.95 | v64.13,77.95 v64.13,88.11 | v107.31,90.65 111.12,94.46 114.93,94.46 114.93,89.38 | 114.93,89.38 114.93,86.84 IC11.40 | v120.01,89.38 125.09,94.46 IC6.7 | 114.93,89.38 v116.2,89.38
  Bottom 0.254: v65.4,41.12 64.13,42.39 v59.05,42.39 | v55.24,77.95 v64.13,77.95 | v64.13,88.11 74.29,88.11 76.83,90.65 v107.31,90.65 | v116.2,89.38 v120.01,89.38
ATNOUT  (via drill 0.61, 0.7)
  Top 0.254: IC6.5 130.17,94.46 128.9,93.19 v126.36,93.19 | v116.2,95.73 v116.2,93.19 | v37.46,62.71 37.46,91.92 38.73,93.19 v46.35,93.19 | v55.24,88.11 55.24,93.19 59.05,93.19 59.05,95.73 v60.32,97
  Bottom 0.254: v116.2,93.19 v126.36,93.19 | v60.32,97 61.59,95.73 v116.2,95.73 | IC9.12 34.92,61.44 36.19,62.71 v37.46,62.71 | v46.35,93.19 48.89,93.19 53.97,88.11 v55.24,88.11
C1MTR
  Bottom 0.254: P5.3 50.16,94.46 51.43,93.19 55.24,93.19 56.51,91.92 JP3.2
C1RD
  Top 0.254: 52.7,98.27 85.72,98.27 86.99,97 86.99,86.84 IC10.40 | 52.7,98.27 P5.4 | P3.8 18.41,75.41 18.41,80.49 20.95,80.49 20.95,85.57 18.41,85.57 18.41,93.19 36.19,93.19 36.19,94.46 40,98.27 52.7,98.27
C1SW  (via drill 0.61)
  Top 0.254: 70.48,74.14 IC10.6 | P1.9 70.48,74.14 | v65.4,94.46 67.94,90.65 70.48,90.65 70.48,74.14
  Bottom 0.254: v65.4,94.46 57.78,94.46 P5.6
C2MTR
  Bottom 0.254: P6.3 55.24,39.85 56.51,38.58 JP4.1
C2RD  (via drill 0.61)
  Top 0.254: v31.11,77.95 31.11,47.47 29.84,46.2 IC9.18
  Bottom 0.254: IC9.18 34.92,46.2 38.73,42.39 P6.4 | P3.6 20.95,77.95 v31.11,77.95
C2SW  (via drill 0.61)
  Top 0.254: 70.48,71.6 IC10.7 | 70.48,71.6 P1.10 | v65.4,47.47 65.4,57.63 70.48,57.63 70.48,71.6
  Bottom 0.254: P6.6 v65.4,47.47
CWR  (via drill 0.61)
  Top 0.254: v76.83,44.93 76.83,9.37 78.1,8.1 IC4.4 | 24.76,86.84 26.03,85.57 26.03,60.17 27.3,58.9 IC9.13 | 24.76,86.84 23.49,86.84 23.49,77.95 19.68,77.95 P3.7 | 24.76,86.84 v24.76,88.11 | v51.43,88.11 51.43,93.19 53.97,93.19 55.24,94.46 P5.5 | v38.73,50.01 v38.73,57.63
  Bottom 0.254: v76.83,44.93 P6.5 52.7,44.93 47.62,50.01 v38.73,50.01 | v24.76,88.11 v51.43,88.11 | v38.73,57.63 33.65,57.63 32.38,58.9 IC9.13
D0  (via drill 0.61)
  Top 0.254: v47.62,90.65 47.62,79.22 46.35,77.95 46.35,72.87 45.08,71.6 IC9.33 42.54,71.6 41.27,70.33 v41.27,65.25 | v6.98,93.19 4.44,90.65 4.44,65.25 P4.A22 | v81.91,69.06 81.91,80.49 83.18,80.49 84.45,79.22 84.45,75.41 85.72,74.14 85.72,70.33 86.99,69.06 IC10.33
  Bottom 0.254: IC10.33 95.88,69.06 97.15,70.33 109.85,70.33 111.12,69.06 IC11.33 | v47.62,90.65 43.81,93.19 v6.98,93.19 | v81.91,69.06 78.1,65.25 v41.27,65.25
D1  (via drill 0.61)
  Top 0.254: v85.72,69.06 85.72,67.79 86.99,66.52 IC10.32
  Bottom 0.254: IC10.32 97.15,66.52 98.42,67.79 108.58,67.79 109.85,66.52 IC11.32 | P4.A21 6.98,61.44 8.25,62.71 12.06,62.71 14.6,65.25 34.92,65.25 38.73,69.06 IC9.32 51.43,69.06 52.7,70.33 81.91,70.33 83.18,69.06 v85.72,69.06
D2  (via drill 0.61)
  Top 0.254: v46.35,70.33 46.35,67.79 45.08,66.52 IC9.31 | v75.56,67.79 v75.56,63.98
  Bottom 0.254: IC11.31 106.04,63.98 104.77,62.71 98.42,62.71 97.15,63.98 IC10.31 v75.56,63.98 | v46.35,70.33 33.65,70.33 31.11,67.79 14.6,67.79 12.06,65.25 9.52,65.25 6.98,62.71 4.44,62.71 4.44,58.9 P4.A20 | v75.56,67.79 52.7,67.79 51.43,66.52 IC9.31
D3  (via drill 0.61)
  Top 0.254: v103.5,60.17 v106.04,62.71 | v38.73,62.71 37.46,61.44 v37.46,42.39 v41.27,38.58 | v85.72,46.2 85.72,60.17 86.99,61.44 IC10.30 | v70.48,47.47 70.48,44.93 67.94,42.39 60.32,42.39 v60.32,41.12
  Bottom 0.254: v103.5,60.17 98.42,60.17 97.15,61.44 IC10.30 | v106.04,62.71 107.31,61.44 IC11.30 | v38.73,62.71 41.27,62.71 42.54,63.98 IC9.30 | v37.46,42.39 34.92,44.93 4.44,44.93 4.44,52.55 6.98,52.55 6.98,56.36 P4.A19 | v85.72,46.2 84.45,47.47 v70.48,47.47 | v60.32,41.12 47.62,41.12 45.08,38.58 v41.27,38.58
D4  (via drill 0.61)
  Top 0.254: v33.65,42.39 34.92,43.66 v34.92,60.17
  Bottom 0.254: IC11.29 104.77,58.9 103.5,57.63 98.42,57.63 97.15,58.9 IC10.29 76.83,58.9 75.56,60.17 46.35,60.17 45.08,61.44 IC9.29 36.19,61.44 v34.92,60.17 | P4.A18 4.44,53.82 3.17,52.55 3.17,42.39 v33.65,42.39
D5  (via drill 0.61)
  Top 0.254: v32.38,57.63 v33.65,58.9
  Bottom 0.254: IC11.28 104.77,56.36 103.5,55.09 98.42,55.09 97.15,56.36 IC10.28 86.99,56.36 85.72,57.63 46.35,57.63 45.08,58.9 IC9.28 v33.65,58.9 | P4.A17 6.98,51.28 9.52,53.82 9.52,57.63 v32.38,57.63
D6
  Bottom 0.254: 46.35,55.09 45.08,56.36 IC9.27 | 46.35,55.09 81.91,55.09 83.18,53.82 IC10.27 93.34,53.82 94.61,52.55 103.5,52.55 104.77,53.82 IC11.27 | P4.A16 8.25,48.74 9.52,50.01 18.41,50.01 23.49,55.09 46.35,55.09
D7  (via drill 0.61)
  Top 0.254: v40,47.47 41.27,48.74 41.27,52.55 42.54,53.82 IC9.26
  Bottom 0.254: IC11.26 113.66,51.28 112.39,50.01 90.8,50.01 89.53,51.28 IC10.26 83.18,51.28 81.91,52.55 60.32,52.55 59.05,53.82 IC9.26 | P4.A15 6.98,47.47 v40,47.47
DAV
  Bottom 0.254: P2.6 156.84,80.49 156.84,97 155.57,98.27 139.06,98.27 137.79,97 IC6.2
DAVIN  (via drill 0.61, 0.7)
  Top 0.254: IC6.1 140.33,93.19 139.06,91.92 139.06,86.84 v136.52,84.3 | v118.74,80.49 112.39,80.49 111.12,81.76 v111.12,88.11 | v47.62,47.47 47.62,66.52 48.89,67.79 v48.89,76.68 | v80.64,79.22 v80.64,89.38
  Bottom 0.254: v136.52,84.3 130.17,84.3 127.63,81.76 120.01,81.76 v118.74,80.49 | v111.12,88.11 93.34,88.11 92.07,89.38 v80.64,89.38 | IC9.17 40,48.74 41.27,47.47 v47.62,47.47 | v48.89,76.68 65.4,76.68 66.67,77.95 74.29,77.95 75.56,79.22 v80.64,79.22
DAVOUT  (via drill 0.61)
  Top 0.254: v98.42,56.36 98.42,42.39 99.69,41.12 IC11.19 | v95.88,57.63 92.07,61.44 92.07,84.3 v94.61,89.38 | v132.71,91.92 135.25,94.46 IC6.3
  Bottom 0.254: v98.42,56.36 97.15,57.63 v95.88,57.63 | v94.61,89.38 111.12,89.38 112.39,90.65 130.17,90.65 131.44,91.92 v132.71,91.92
DEC0  (via drill 0.61)
  Top 0.254: v128.9,33.5 128.9,34.77 127.63,36.04 IC5.1
  Bottom 0.254: v128.9,33.5 130.17,32.23 U$1.12 145.41,32.23 151.76,25.88 U$3.9
DEC1
  Top 0.254: IC5.2 125.09,33.5 122.55,36.04 120.01,36.04 120.01,10.64 127.63,3.02 141.6,3.02 141.6,10.64 147.95,10.64 147.95,27.15 145.41,29.69 U$1.11
  Bottom 0.254: U$3.10 151.76,23.34 150.49,23.34 147.95,25.88 147.95,27.15 145.41,29.69 U$1.11
DEC2
  Bottom 0.254: IC5.3 127.63,30.96 131.44,27.15 U$1.10 146.68,27.15 146.68,23.34 147.95,22.07 149.22,22.07 151.76,19.53 U$3.11
DEC3  (via drill 0.61)
  Top 0.254: v146.68,16.99 146.68,23.34 145.41,24.61 U$1.9
  Bottom 0.254: IC5.4 128.9,28.42 131.44,25.88 131.44,24.61 U$1.9 | v146.68,16.99 151.76,16.99 U$3.12
DEC4  (via drill 0.61)
  Top 0.254: v150.49,18.26 150.49,15.72 151.76,14.45 U$3.13
  Bottom 0.254: IC5.5 127.63,25.88 131.44,22.07 U$1.8 145.41,22.07 147.95,19.53 149.22,19.53 v150.49,18.26
DEC5  (via drill 0.61)
  Top 0.254: v150.49,32.23 146.68,36.04 141.6,36.04 141.6,20.8 142.87,19.53 U$1.7
  Bottom 0.254: IC5.6 127.63,23.34 131.44,19.53 U$1.7 | v150.49,32.23 153.03,32.23 153.03,44.93 154.3,46.2 U$3.14
DEC6  (via drill 0.61)
  Top 0.254: v146.68,13.18 146.68,15.72 145.41,16.99 U$1.6
  Bottom 0.254: IC5.7 127.63,20.8 131.44,16.99 U$1.6 | v146.68,13.18 156.84,13.18 156.84,41.12 154.3,43.66 U$3.15
DEC7  (via drill 0.61)
  Top 0.254: v135.25,14.45 135.25,18.26 IC5.9
  Bottom 0.254: v135.25,14.45 U$1.5 149.22,14.45 150.49,15.72 153.03,15.72 153.03,16.99 155.57,16.99 155.57,39.85 154.3,41.12 U$3.16
DEC8  (via drill 0.61)
  Top 0.254: v135.25,11.91 131.44,15.72 131.44,19.53 132.71,20.8 IC5.10 | v155.57,11.91 155.57,36.04 154.3,37.31 U$3.17
  Bottom 0.254: v135.25,11.91 U$1.4 v155.57,11.91
DEC9  (via drill 0.61)
  Top 0.254: v133.98,11.91 130.17,15.72 130.17,20.8 132.71,23.34 IC5.11 | U$3.18 154.3,34.77 153.03,33.5 153.03,13.18 146.68,6.83 145.41,6.83 145.41,9.37 U$1.3
  Bottom 0.254: v133.98,11.91 136.52,9.37 U$1.3
DI1
  Bottom 0.254: IC11.2 112.39,84.3 113.66,83.03 IC8.1
DI2
  Bottom 0.254: IC11.3 112.39,81.76 113.66,80.49 117.47,80.49 118.74,79.22 130.17,79.22 131.44,80.49 IC8.15
DI3  (via drill 0.61)
  Top 0.254: v109.85,67.79 107.31,70.33 107.31,75.41 103.5,79.22 IC11.4
  Bottom 0.254: v109.85,67.79 IC8.7
DI4  (via drill 0.61)
  Top 0.254: v122.55,75.41 v122.55,69.06 | v104.77,75.41 102.23,75.41 102.23,76.68 IC11.5
  Bottom 0.254: v122.55,69.06 127.63,69.06 131.44,65.25 IC8.9 | v104.77,75.41 v122.55,75.41
DI5  (via drill 0.61)
  Top 0.254: v103.5,61.44 103.5,72.87 102.23,74.14 IC11.6
  Bottom 0.254: v103.5,61.44 106.04,61.44 107.31,60.17 IC7.1
DI6  (via drill 0.61)
  Top 0.254: v120.01,72.87 v120.01,58.9
  Bottom 0.254: v120.01,72.87 106.04,72.87 104.77,71.6 IC11.7 | v120.01,58.9 122.55,56.36 130.17,56.36 131.44,57.63 IC7.15
DI7  (via drill 0.61)
  Top 0.254: v97.15,46.2 v97.15,69.06
  Bottom 0.254: v97.15,46.2 98.42,44.93 IC7.7 | v97.15,69.06 IC11.8
DI8  (via drill 0.61)
  Top 0.254: v107.31,66.52 108.58,65.25 108.58,60.17 107.31,58.9 v107.31,39.85 | v131.44,38.58 132.71,39.85 IC7.9
  Bottom 0.254: v107.31,39.85 128.9,39.85 130.17,38.58 v131.44,38.58 | v107.31,66.52 IC11.9
DIAG  (via drill 0.61)
  Top 0.254: v56.51,39.85 v56.51,29.69 56.51,22.07 55.24,20.8 IC3.2 | v78.1,66.52 v78.1,39.85 v79.37,38.58 | P3.5 17.14,84.3 17.14,89.38 15.87,90.65 12.06,90.65 v12.06,34.77 | v121.28,28.42 121.28,22.07 128.9,22.07 128.9,11.91 U$2.1 | v97.15,39.85 v97.15,30.96
  Bottom 0.254: v56.51,39.85 v78.1,39.85 | v78.1,66.52 IC10.9 P1.12 | v12.06,34.77 17.14,29.69 v56.51,29.69 | v121.28,28.42 118.74,30.96 v97.15,30.96 | v97.15,39.85 80.64,39.85 v79.37,38.58
DIO1
  Bottom 0.254: P2.1 158.11,67.79 158.11,77.95 156.84,79.22 136.52,79.22 133.98,81.76 131.44,81.76 130.17,80.49 IC8.2
DIO2  (via drill 0.61)
  Top 0.254: v154.3,76.68 154.3,71.6 P2.2
  Bottom 0.254: v154.3,76.68 135.25,76.68 133.98,77.95 IC8.14
DIO3
  Bottom 0.254: P2.3 154.3,71.6 127.63,71.6 126.36,70.33 IC8.6
DIO4  (via drill 0.61)
  Top 0.254: v150.49,70.33 150.49,71.6 151.76,72.87 v151.76,74.14
  Bottom 0.254: v150.49,70.33 136.52,70.33 133.98,67.79 IC8.10 | v151.76,74.14 154.3,74.14 P2.4
DIO5
  Bottom 0.254: P2.A 153.03,66.52 149.22,66.52 149.22,61.44 147.95,60.17 139.06,60.17 137.79,58.9 127.63,58.9 126.36,57.63 IC7.2
DIO6  (via drill 0.61)
  Top 0.254: v150.49,57.63 153.03,60.17 153.03,65.25 154.3,66.52 154.3,69.06 P2.B
  Bottom 0.254: v150.49,57.63 136.52,57.63 133.98,55.09 IC7.14
DIO7  (via drill 0.61)
  Top 0.254: v136.52,46.2 v136.52,50.01 | v147.95,56.36 151.76,60.17 151.76,71.6 P2.C
  Bottom 0.254: v136.52,46.2 127.63,46.2 126.36,47.47 IC7.6 | v136.52,50.01 142.87,56.36 v147.95,56.36
DIO8  (via drill 0.61)
  Top 0.254: v139.06,44.93 v139.06,75.41
  Bottom 0.254: v139.06,75.41 P2.D | IC7.10 v139.06,44.93
DO1  (via drill 0.61)
  Top 0.254: v98.42,76.68 98.42,65.25 99.69,63.98 IC11.10
  Bottom 0.254: v98.42,76.68 98.42,77.95 IC8.3
DO2  (via drill 0.61, 0.7)
  Top 0.254: v94.61,62.71 94.61,75.41 99.69,80.49 104.77,80.49 v106.04,79.22 | v112.39,79.22 113.66,77.95 117.47,77.95 v118.74,76.68
  Bottom 0.254: v94.61,62.71 97.15,62.71 98.42,61.44 IC11.11 | v118.74,76.68 130.17,76.68 131.44,75.41 IC8.13 | v106.04,79.22 v112.39,79.22
DO3  (via drill 0.61)
  Top 0.254: v106.04,43.66 v106.04,60.17 | v109.85,43.66 111.12,44.93 v111.12,70.33
  Bottom 0.254: v106.04,60.17 104.77,60.17 103.5,58.9 IC11.12 | v106.04,43.66 v109.85,43.66 | v111.12,70.33 121.28,70.33 123.82,72.87 IC8.5
DO4  (via drill 0.61)
  Top 0.254: v103.5,43.66 103.5,55.09 102.23,56.36 IC11.13 | v135.25,43.66 135.25,69.06 133.98,70.33 IC8.11
  Bottom 0.254: v103.5,43.66 104.77,42.39 121.28,42.39 122.55,43.66 v135.25,43.66
DO5
  Bottom 0.254: IC11.14 103.5,53.82 104.77,55.09 IC7.3
DO6
  Bottom 0.254: IC11.15 112.39,51.28 113.66,52.55 121.28,52.55 122.55,53.82 130.17,53.82 131.44,52.55 IC7.13
DO7
  Bottom 0.254: IC11.16 112.39,48.74 113.66,50.01 IC7.5
DO8
  Bottom 0.254: IC11.17 112.39,46.2 113.66,47.47 121.28,47.47 122.55,48.74 128.9,48.74 130.17,47.47 IC7.11
EOI  (via drill 0.61)
  Top 0.254: R4.1 v74.29,10.64 74.29,16.99 73.02,18.26 IC12.2
  Bottom 0.254: v74.29,10.64 88.26,10.64 R5.1 95.88,8.1 146.68,8.1 149.22,10.64 158.11,10.64 158.11,63.98 154.3,63.98 154.3,69.06 156.84,69.06 156.84,76.68 P2.5 | R4.1 66.67,3.02 64.13,5.56 59.05,5.56 57.78,4.29 JP6.2
EOIOUT  (via drill 0.61)
  Top 0.254: v69.21,32.23 69.21,24.61 70.48,23.34 IC12.1 | v74.29,32.23 74.29,36.04 75.56,37.31 75.56,56.36 76.83,57.63 v76.83,83.03
  Bottom 0.254: v69.21,32.23 v74.29,32.23 | v76.83,83.03 78.1,84.3 IC10.39
GND  (via drill 0.61)
  Top 0.254: P4.A1 P4.C1 C12.- | C8.2 67.94,23.34 67.94,13.18 C13.2 v66.67,5.56 | IC5.8 126.36,9.37 128.9,6.83 U$2.3 132.71,5.56 140.33,5.56 v140.33,42.39 | 86.99,5.56 JP7.3 | 86.99,5.56 85.72,5.56 IC4.7 | 86.99,5.56 86.99,14.45 | 86.99,14.45 86.99,16.99 85.72,18.26 IC12.7 | 86.99,14.45 90.8,18.26 R5.2 90.8,27.15 | v88.26,34.77 90.8,32.23 90.8,27.15 | C5.1 103.5,22.07 98.42,16.99 93.34,16.99 93.34,24.61 90.8,27.15 | 127.63,51.28 127.63,43.66 126.36,42.39 IC7.8 | 127.63,51.28 126.36,52.55 IC7.4 | 127.63,63.98 126.36,65.25 IC8.8 | 127.63,63.98 127.63,51.28 | 127.63,63.98 v127.63,72.87 127.63,74.14 126.36,75.41 IC8.4 | 136.52,75.41 137.79,76.68 C3.1 | 136.52,75.41 133.98,72.87 IC8.12 | 136.52,75.41 C1.1 | 142.87,58.9 R2.2 | 142.87,58.9 R3.1 v140.33,47.47 | P2.N P2.M P2.L P2.K P2.J 153.03,84.3 | P2.E P2.F P2.H 153.03,84.3 | 142.87,58.9 142.87,81.76 145.41,84.3 153.03,84.3 | P3.1 P3.A 23.49,90.65 23.49,89.38 IC9.1 33.65,89.38 37.46,93.19 37.46,94.46 45.08,94.46 P5.1 | P4.A28 P4.A29 P4.A30 P4.A31 P4.A32 P4.C32 | P3.12 13.33,70.33 v13.33,89.38 | IC10.1 71.75,86.84 71.75,91.92 69.21,94.46 P1.1 | C7.2 33.65,25.88 32.38,24.61 32.38,16.99 33.65,15.72 36.19,15.72 36.19,14.45 37.46,13.18 IC1.4 40,13.18 42.54,15.72 42.54,22.07 43.81,23.34 C10.2
  Bottom 0.254: 18.41,4.29 19.68,3.02 IC2.8 | 18.41,4.29 12.06,4.29 C12.- | 18.41,4.29 36.19,4.29 37.46,3.02 IC1.8 41.27,3.02 41.27,9.37 | 41.27,9.37 41.27,11.91 40,13.18 IC1.4 | 41.27,9.37 51.43,9.37 52.7,8.1 IC3.7 | C7.2 36.19,34.77 P6.1 | 42.54,23.34 27.3,23.34 C11.2 29.84,28.42 57.78,28.42 C9.2 | C10.2 42.54,23.34 | C8.2 48.89,24.61 47.62,23.34 42.54,23.34 | C5.1 104.77,34.77 136.52,34.77 C4.1 146.68,33.5 146.68,32.23 149.22,29.69 154.3,29.69 U$3.20 | U$1.1 132.71,4.29 U$2.3 127.63,4.29 102.23,4.29 BEEP1.2 97.15,6.83 IC4.7 85.72,5.56 84.45,4.29 67.94,4.29 v66.67,5.56 | v88.26,34.77 C6.1 | IC7.12 131.44,50.01 128.9,52.55 IC7.4 | IC6.12 130.17,89.38 131.44,90.65 C2.1 P2.L | P2.F C3.1 | IC8.12 v127.63,72.87 | P3.12 P3.N | P4.C32 v13.33,89.38 15.87,91.92 P3.1 | 131.44,98.27 123.82,98.27 122.55,97 IC6.8 122.55,94.46 P1.1 66.67,94.46 65.4,93.19 56.51,93.19 56.51,98.27 46.35,98.27 45.08,97 P5.1 | 131.44,98.27 132.71,97 IC6.4 | IC11.1 92.07,86.84 90.8,88.11 75.56,88.11 74.29,86.84 IC10.1 | P2.M 136.52,93.19 136.52,98.27 131.44,98.27 | v140.33,42.39 v140.33,47.47
GRAPHIC  (via drill 0.61, 0.7)
  Top 0.254: v24.76,83.03 24.76,71.6 23.49,70.33 20.95,70.33 20.95,67.79 P3.11 | v150.49,62.71 150.49,69.06 149.22,70.33 v149.22,77.95 | v127.63,77.95 126.36,79.22 123.82,79.22 122.55,80.49 122.55,84.3 v123.82,85.57 | v118.74,88.11 117.47,89.38 117.47,95.73 v118.74,97 | v59.05,86.84 59.05,88.11 60.32,89.38 60.32,95.73 v61.59,97
  Bottom 0.254: v24.76,83.03 31.11,83.03 34.92,86.84 IC9.39 v59.05,86.84 | v150.49,62.71 JP2.1 | v149.22,77.95 135.25,77.95 133.98,79.22 131.44,79.22 130.17,77.95 v127.63,77.95 | v123.82,85.57 122.55,85.57 121.28,86.84 120.01,86.84 v118.74,88.11 | v118.74,97 117.47,98.27 61.59,98.27 v61.59,97
IC10EOI  (via drill 0.61)
  Top 0.254: v59.05,9.37 59.05,5.56 60.32,4.29 JP6.3 | v50.16,20.8 50.16,48.74 51.43,50.01 v51.43,67.79
  Bottom 0.254: IC10.8 P1.11 52.7,69.06 v51.43,67.79 | v59.05,9.37 56.51,11.91 48.89,11.91 48.89,19.53 | 48.89,19.53 33.65,19.53 31.11,22.07 17.14,22.07 12.06,27.15 9.52,27.15 6.98,29.69 6.98,39.85 4.44,39.85 1.9,42.39 1.9,83.03 17.14,83.03 18.41,84.3 P3.4 | 48.89,19.53 v50.16,20.8
IECRES  (via drill 0.61)
  Top 0.254: v104.77,22.07 104.77,60.17 v107.31,62.71 | R1.1 JP5.1
  Bottom 0.254: v104.77,22.07 79.37,22.07 78.1,20.8 IC12.4 | v107.31,62.71 141.6,62.71 R1.1 R2.1
IFC
  Bottom 0.254: P2.9 154.3,86.84 150.49,86.84 149.22,85.57 JP5.2
KI0  (via drill 0.61)
  Top 0.254: RN1.2 65.4,63.98 | 65.4,63.98 P1.13 | 65.4,63.98 65.4,72.87 75.56,72.87 v75.56,71.6 | v97.15,71.6 97.15,76.68 98.42,77.95 103.5,77.95 106.04,75.41 106.04,72.87 104.77,71.6 104.77,65.25 106.04,63.98 107.31,63.98 v107.31,65.25 | v144.14,66.52 145.41,65.25 145.41,52.55 U$1.20
  Bottom 0.254: P1.13 IC10.10 | U$1.20 145.41,52.55 150.49,47.47 151.76,47.47 U$3.1 | v75.56,71.6 83.18,71.6 84.45,70.33 94.61,70.33 95.88,71.6 v97.15,71.6 | v107.31,65.25 121.28,65.25 122.55,63.98 135.25,63.98 135.25,66.52 v144.14,66.52
KI1  (via drill 0.61)
  Top 0.254: v56.51,88.11 56.51,75.41 57.78,74.14 57.78,61.44 RN1.3 | v111.12,93.19 113.66,90.65 v113.66,85.57 | v121.28,85.57 v121.28,51.28
  Bottom 0.254: RN1.3 P1.14 IC10.11 | 146.68,48.74 150.49,44.93 151.76,44.93 U$3.2 | 146.68,48.74 145.41,50.01 U$1.19 | v56.51,88.11 61.59,88.11 64.13,90.65 74.29,90.65 76.83,93.19 v111.12,93.19 | v113.66,85.57 v121.28,85.57 | v121.28,51.28 127.63,51.28 130.17,48.74 146.68,48.74
KI2  (via drill 0.61)
  Top 0.254: RN1.4 65.4,58.9 | 65.4,58.9 P1.15 | 65.4,58.9 65.4,62.71 59.05,62.71 59.05,74.14 57.78,75.41 57.78,88.11 v59.05,90.65 | v74.29,91.92 83.18,91.92 v83.18,83.03 | v108.58,85.57 108.58,80.49 113.66,75.41 113.66,47.47 122.55,47.47 122.55,41.12 126.36,37.31 130.17,37.31 v130.17,39.85
  Bottom 0.254: P1.15 IC10.12 | 150.49,43.66 151.76,42.39 U$3.3 | 150.49,43.66 149.22,44.93 147.95,44.93 145.41,47.47 U$1.18 | v59.05,90.65 61.59,90.65 64.13,91.92 v74.29,91.92 | v83.18,83.03 90.8,83.03 93.34,85.57 v108.58,85.57 | v130.17,39.85 131.44,41.12 147.95,41.12 150.49,43.66
KI3  (via drill 0.61)
  Top 0.254: P1.16 IC10.13 74.29,56.36 75.56,57.63 v75.56,61.44 | v147.95,43.66 151.76,39.85 U$3.4 | v90.8,60.17 95.88,55.09 95.88,43.66 98.42,41.12 98.42,29.69 97.15,28.42 v97.15,19.53 | v136.52,13.18 136.52,27.15 139.06,29.69 139.06,42.39 141.6,44.93 U$1.17
  Bottom 0.254: P1.16 RN1.5 | v147.95,43.66 146.68,43.66 145.41,44.93 U$1.17 | v75.56,61.44 76.83,60.17 v90.8,60.17 | v97.15,19.53 102.23,14.45 133.98,14.45 135.25,13.18 v136.52,13.18
KI4  (via drill 0.61)
  Top 0.254: P1.17 IC10.14 | 146.68,41.12 151.76,36.04 U$3.5 | 146.68,41.12 145.41,42.39 U$1.16 | v81.91,53.82 v81.91,65.25 | v144.14,74.14 146.68,71.6 146.68,41.12 | v93.34,67.79 93.34,75.41 99.69,83.03 103.5,83.03 106.04,86.84 109.85,86.84 109.85,80.49 114.93,75.41 118.74,75.41 v120.01,74.14
  Bottom 0.254: RN1.6 P1.17 | v81.91,65.25 84.45,67.79 v93.34,67.79 | v120.01,74.14 v144.14,74.14 | IC10.14 v81.91,53.82
KI5  (via drill 0.61)
  Top 0.254: P1.18 IC10.15 | U$1.15 145.41,39.85 151.76,33.5 U$3.6 | v81.91,51.28 v83.18,52.55 | v93.34,52.55 v93.34,32.23 | v111.12,29.69 121.28,39.85 v121.28,41.12 | v130.17,41.12 v131.44,39.85
  Bottom 0.254: RN1.7 P1.18 | v83.18,52.55 v93.34,52.55 | v93.34,32.23 95.88,29.69 v111.12,29.69 | v121.28,41.12 v130.17,41.12 | IC10.15 v81.91,51.28 | v131.44,39.85 U$1.15
KI6  (via drill 0.61)
  Top 0.254: P1.19 IC10.16 | v94.61,47.47 v94.61,32.23 | v136.52,29.69 v136.52,37.31
  Bottom 0.254: RN1.8 P1.19 | U$3.7 149.22,30.96 149.22,33.5 145.41,37.31 U$1.14 v136.52,37.31 | v94.61,47.47 85.72,47.47 84.45,48.74 IC10.16 | v94.61,32.23 128.9,32.23 131.44,29.69 v136.52,29.69
KI7  (via drill 0.61)
  Top 0.254: RN1.9 P1.20 | 149.22,30.96 151.76,28.42 U$3.8 | 149.22,30.96 145.41,34.77 U$1.13 | v95.88,42.39 95.88,19.53 97.15,18.26 98.42,18.26 v98.42,19.53 | v149.22,15.72 149.22,30.96
  Bottom 0.254: P1.20 IC10.17 78.1,46.2 79.37,44.93 81.91,44.93 84.45,42.39 v95.88,42.39 | v98.42,19.53 102.23,15.72 v149.22,15.72
N$1  (via drill 0.61)
  Top 0.254: v59.05,11.91 59.05,16.99 60.32,18.26 IC3.12 | v75.56,11.91 IC4.3
  Bottom 0.254: v59.05,11.91 64.13,11.91 65.4,10.64 73.02,10.64 74.29,11.91 v75.56,11.91
N$2  (via drill 0.61)
  Top 0.254: JP7.6 JP7.4 JP7.2 v92.07,24.61
  Bottom 0.254: v92.07,24.61 69.21,24.61 67.94,23.34 65.4,23.34 62.86,20.8 IC3.13
N$3
  Bottom 0.254: R6.1 50.16,18.26 IC3.3
N$4  (via drill 0.61)
  Top 0.254: v78.1,9.37 v80.64,11.91 | v93.34,14.45 95.88,11.91 BEEP1.1
  Bottom 0.254: R6.2 53.97,6.83 66.67,6.83 69.21,9.37 v78.1,9.37 | v80.64,11.91 86.99,11.91 89.53,14.45 v93.34,14.45
N$15  (via drill 0.61)
  Top 0.254: v73.02,22.07 IC12.13
  Bottom 0.254: v73.02,22.07 69.21,22.07 66.67,19.53 59.05,19.53 56.51,16.99 51.43,16.99 51.43,14.45 59.05,14.45 60.32,15.72 IC3.11
N$16  (via drill 0.61)
  Top 0.254: v57.78,36.04 57.78,13.18 55.24,10.64 IC3.6 | v83.18,37.31 IC12.9
  Bottom 0.254: v57.78,36.04 59.05,37.31 v83.18,37.31
N$17  (via drill 0.61)
  Top 0.254: v64.13,29.69 59.05,34.77 59.05,41.12 56.51,43.66 56.51,58.9 55.24,60.17 55.24,74.14 53.97,75.41 JP3.1 | v85.72,30.96 IC12.8
  Bottom 0.254: v85.72,30.96 76.83,30.96 75.56,29.69 v64.13,29.69
N$19  (via drill 0.61)
  Top 0.254: v80.64,36.04 IC12.10
  Bottom 0.254: JP4.2 v80.64,36.04
N$20  (via drill 0.61)
  Top 0.254: v122.55,25.88 122.55,32.23 128.9,32.23 130.17,33.5 IC5.15 | v79.37,29.69 79.37,37.31 80.64,38.58 80.64,66.52 79.37,67.79 79.37,86.84 78.1,86.84 75.56,84.3 IC10.2
  Bottom 0.254: IC10.2 P1.5 | v122.55,25.88 90.8,25.88 86.99,29.69 v79.37,29.69
N$21  (via drill 0.61)
  Top 0.254: v123.82,25.88 123.82,29.69 128.9,29.69 128.9,30.96 IC5.14 | v89.53,20.8 88.26,22.07 v88.26,29.69 | v53.97,30.96 51.43,33.5 51.43,48.74 52.7,50.01 v52.7,72.87 | v64.13,72.87 64.13,75.41 65.4,76.68 65.4,80.49 66.67,81.76 P1.6
  Bottom 0.254: v123.82,25.88 123.82,20.8 v89.53,20.8 | v88.26,29.69 85.72,32.23 76.83,32.23 75.56,30.96 v53.97,30.96 | v52.7,72.87 v64.13,72.87 | P1.6 IC10.3
N$22  (via drill 0.61)
  Top 0.254: v128.9,27.15 128.9,28.42 IC5.13 | v92.07,32.23 v92.07,55.09 | v83.18,55.09 v83.18,79.22
  Bottom 0.254: v128.9,27.15 97.15,27.15 v92.07,32.23 | v92.07,55.09 v83.18,55.09 | v83.18,79.22 81.91,80.49 75.56,80.49 74.29,79.22 IC10.4 P1.7
N$23  (via drill 0.61)
  Top 0.254: v122.55,24.61 128.9,24.61 128.9,25.88 IC5.12 | v114.93,24.61 108.58,30.96 108.58,58.9 109.85,60.17 109.85,66.52 v107.31,69.06 | v109.85,69.06 108.58,70.33 108.58,79.22 v107.31,80.49
  Bottom 0.254: P1.8 IC10.5 74.29,76.68 75.56,77.95 83.18,77.95 85.72,80.49 v107.31,80.49 | v114.93,24.61 v122.55,24.61 | v107.31,69.06 v109.85,69.06
N$24  (via drill 0.61)
  Top 0.254: v67.94,9.37 69.21,10.64 v69.21,23.34 | v78.1,23.34 IC12.11
  Bottom 0.254: v67.94,9.37 64.13,9.37 62.86,8.1 IC3.8 | v69.21,23.34 v78.1,23.34
N$27
  Bottom 0.254: JP7.1 88.26,9.37 84.45,9.37 83.18,8.1 IC4.6
N$32
  Bottom 0.254: IC1.5 37.46,10.64 36.19,11.91 JP1.2
N$33
  Top 0.254: IC2.15 29.84,18.26 32.38,15.72 32.38,14.45 JP1.1
N$34
  Bottom 0.254: IC2.7 22.22,5.56 26.03,9.37 JP1.3
NDAC
  Bottom 0.254: P2.8 154.3,84.3 145.41,84.3 144.14,85.57 126.36,85.57 125.09,86.84 IC6.10
NDACIN  (via drill 0.61)
  Top 0.254: v34.92,66.52 v34.92,74.14 | v59.05,75.41 59.05,85.57 60.32,86.84 60.32,88.11 61.59,89.38 61.59,95.73 v62.86,97 | v118.74,95.73 118.74,89.38 120.01,88.11 IC6.9
  Bottom 0.254: v34.92,74.14 36.19,75.41 v59.05,75.41 | v62.86,97 117.47,97 v118.74,95.73 | IC9.10 v34.92,66.52
NDACOUT  (via drill 0.61)
  Top 0.254: v127.63,84.3 IC6.11
  Bottom 0.254: IC11.39 v127.63,84.3
NRFD  (via drill 0.61)
  Top 0.254: v118.74,36.04 v121.28,38.58 | v126.36,38.58 128.9,41.12 128.9,83.03 130.17,84.3 135.25,84.3 | IC12.12 v75.56,32.23 | 135.25,84.3 IC6.14 | v136.52,81.76 135.25,83.03 135.25,84.3
  Bottom 0.254: v75.56,32.23 76.83,33.5 98.42,33.5 100.96,36.04 v118.74,36.04 | v121.28,38.58 v126.36,38.58 | P2.7 154.3,81.76 v136.52,81.76
NRFDIN  (via drill 0.61)
  Top 0.254: v53.97,52.55 v53.97,62.71 | v90.8,62.71 v90.8,76.68 | v94.61,79.22 95.88,84.3 98.42,88.11 99.69,89.38 111.12,89.38 112.39,88.11 112.39,84.3 113.66,83.03 118.74,83.03 120.01,84.3 120.01,85.57 121.28,86.84 122.55,85.57 123.82,86.84 127.63,83.03 128.9,84.3 128.9,85.57 133.98,85.57 133.98,90.65 137.79,90.65 IC6.15
  Bottom 0.254: v53.97,52.55 31.11,52.55 29.84,51.28 IC9.16 | v53.97,62.71 v90.8,62.71 | v90.8,76.68 93.34,79.22 v94.61,79.22
NRFDOUT  (via drill 0.61)
  Top 0.254: v50.16,67.79 v50.16,83.03 | v75.56,85.57 v75.56,90.65 | v130.17,91.92 132.71,89.38 IC6.13
  Bottom 0.254: v50.16,67.79 41.27,67.79 37.46,63.98 IC9.11 | v50.16,83.03 62.86,83.03 65.4,85.57 v75.56,85.57 | v75.56,90.65 76.83,91.92 v130.17,91.92
PHI2  (via drill 0.61)
  Top 0.254: v34.92,75.41 36.19,74.14 v36.19,51.28
  Bottom 0.254: IC11.25 113.66,48.74 112.39,47.47 98.42,47.47 97.15,48.74 IC10.25 86.99,48.74 85.72,50.01 60.32,50.01 59.05,51.28 IC9.25 v36.19,51.28 | P4.C26 12.06,75.41 v34.92,75.41
R/-W  (via drill 0.61)
  Top 0.254: v83.18,42.39 v83.18,38.58 | v13.33,69.06 18.41,63.98 18.41,51.28 v19.68,50.01 | v36.19,50.01 v36.19,46.2
  Bottom 0.254: IC11.21 107.31,38.58 106.04,39.85 98.42,39.85 97.15,38.58 IC10.21 v83.18,38.58 | v83.18,42.39 70.48,42.39 69.21,43.66 IC9.22 38.73,43.66 v36.19,46.2 | v13.33,69.06 P4.C25 | v19.68,50.01 v36.19,50.01
SHIELD  (via drill 0.61)
  Top 0.254: R3.2 141.6,70.33 141.6,83.03 151.76,93.19 v151.76,94.46
  Bottom 0.254: v151.76,94.46 154.3,94.46 P2.12
UP0
  Bottom 0.254: P3.C IC9.2
UP1
  Bottom 0.254: P3.D IC9.3
UP2
  Bottom 0.254: P3.E IC9.4
UP3
  Bottom 0.254: P3.F IC9.5
UP4
  Bottom 0.254: P3.H IC9.6
UP5
  Bottom 0.254: P3.J IC9.7
UP6
  Bottom 0.254: P3.K IC9.8
UP7
  Bottom 0.254: P3.L IC9.9
UPCA1
  Bottom 0.254: P3.B 24.76,89.38 26.03,90.65 41.27,90.65 42.54,89.38 IC9.40
UPCB2/BEEP  (via drill 0.61)
  Top 0.254: v22.22,43.66 20.95,44.93 20.95,65.25 P3.M | IC3.1 52.7,23.34 51.43,22.07 51.43,9.37 48.89,6.83 26.03,6.83 26.03,22.07 27.3,23.34 27.3,38.58 26.03,39.85 26.03,42.39 27.3,43.66 IC9.19
  Bottom 0.254: IC9.19 v22.22,43.66
VCC  (via drill 0.61)
  Top 0.254: C9.1 IC3.14 62.86,23.34 64.13,22.07 v64.13,14.45 R4.2 64.13,1.75 76.83,1.75 80.64,5.56 IC4.5 | v62.86,85.57 RN1.1 | P4.C2 P4.C3 | IC1.6 40,8.1 43.81,11.91 43.81,19.53 45.08,20.8 IC1.16 C10.1 46.35,47.47 45.08,48.74 | 45.08,48.74 46.35,50.01 46.35,66.52 47.62,67.79 47.62,77.95 48.89,79.22 v48.89,85.57 48.89,91.92 47.62,93.19 P5.2 | 45.08,48.74 IC9.24 | C2.2 IC6.16 140.33,86.84 137.79,84.3 C3.2 | C5.2 IC11.20 102.23,38.58 103.5,39.85 v103.5,42.39 | v147.95,61.44 R1.2 | C4.2 137.79,60.17 C1.2 | IC8.16 131.44,83.03 130.17,81.76 130.17,61.44 131.44,60.17 IC7.16 | IC2.16 C11.1 31.11,27.15 C7.1 31.11,39.85 29.84,41.12 IC9.20 | IC11.22 117.47,41.12 118.74,42.39 118.74,44.93 117.47,46.2 IC11.24 | IC10.22 89.53,41.12 90.8,42.39 90.8,44.93 89.53,46.2 IC10.24 | C6.2 IC10.20
  Bottom 0.254: IC12.14 C8.1 C9.1 60.32,25.88 48.89,25.88 47.62,27.15 31.11,27.15 C11.1 | IC4.14 C13.1 v64.13,14.45 | JP7.5 88.26,1.75 65.4,1.75 R4.2 | P1.4 64.13,86.84 v62.86,85.57 v48.89,85.57 | 13.33,11.91 13.33,13.18 P4.C2 | C12.+ 13.33,11.91 | 13.33,11.91 31.11,11.91 31.11,10.64 36.19,10.64 36.19,8.1 IC1.6 | IC3.14 60.32,23.34 59.05,22.07 48.89,22.07 47.62,20.8 IC1.16 | IC8.16 C3.2 | C4.2 IC5.16 132.71,36.04 131.44,37.31 103.5,37.31 102.23,38.58 IC11.20 | IC7.16 133.98,60.17 135.25,61.44 C1.2 v147.95,61.44 | R7.1 27.3,37.31 C7.1 32.38,38.58 40,38.58 41.27,37.31 P6.2 55.24,37.31 57.78,34.77 C6.2 | IC10.20 78.1,38.58 80.64,41.12 IC10.22 95.88,41.12 97.15,42.39 v103.5,42.39 104.77,41.12 IC11.22
VDRIVE  (via drill 0.61)
  Top 0.254: v81.91,43.66 81.91,22.07 83.18,20.8 IC12.6 | R7.2 v32.38,53.82 | v24.76,53.82 v24.76,70.33 | v66.67,32.23 66.67,38.58 71.75,43.66 IC10.18
  Bottom 0.254: IC10.18 v81.91,43.66 | v32.38,53.82 IC9.15 v24.76,53.82 | P3.9 20.95,70.33 v24.76,70.33 | R7.2 v66.67,32.23
VSYNC
  Top 0.254: IC12.5 80.64,18.26 81.91,16.99 81.91,11.91 84.45,9.37 84.45,4.29 86.99,1.75 98.42,1.75 98.42,4.29 100.96,6.83 122.55,6.83 127.63,1.75 156.84,1.75 156.84,60.17 JP2.2

### Text on the board
Top: CSA-PETIO-V1.1B | (C) A. Fachat